# EasyEDA Pro project ProPrj_直流采样模块_2026-01-25.epro

# Schematic Schematic1
Board Name: Board1; Create Date: 2025-07-21; Page Name: P1; Project Name: 直流采样模块; Schematic Name: Schematic1; Update Date: 2025-07-21; Company: 嘉立创EDA; Page Size: A2; Version: V1.0
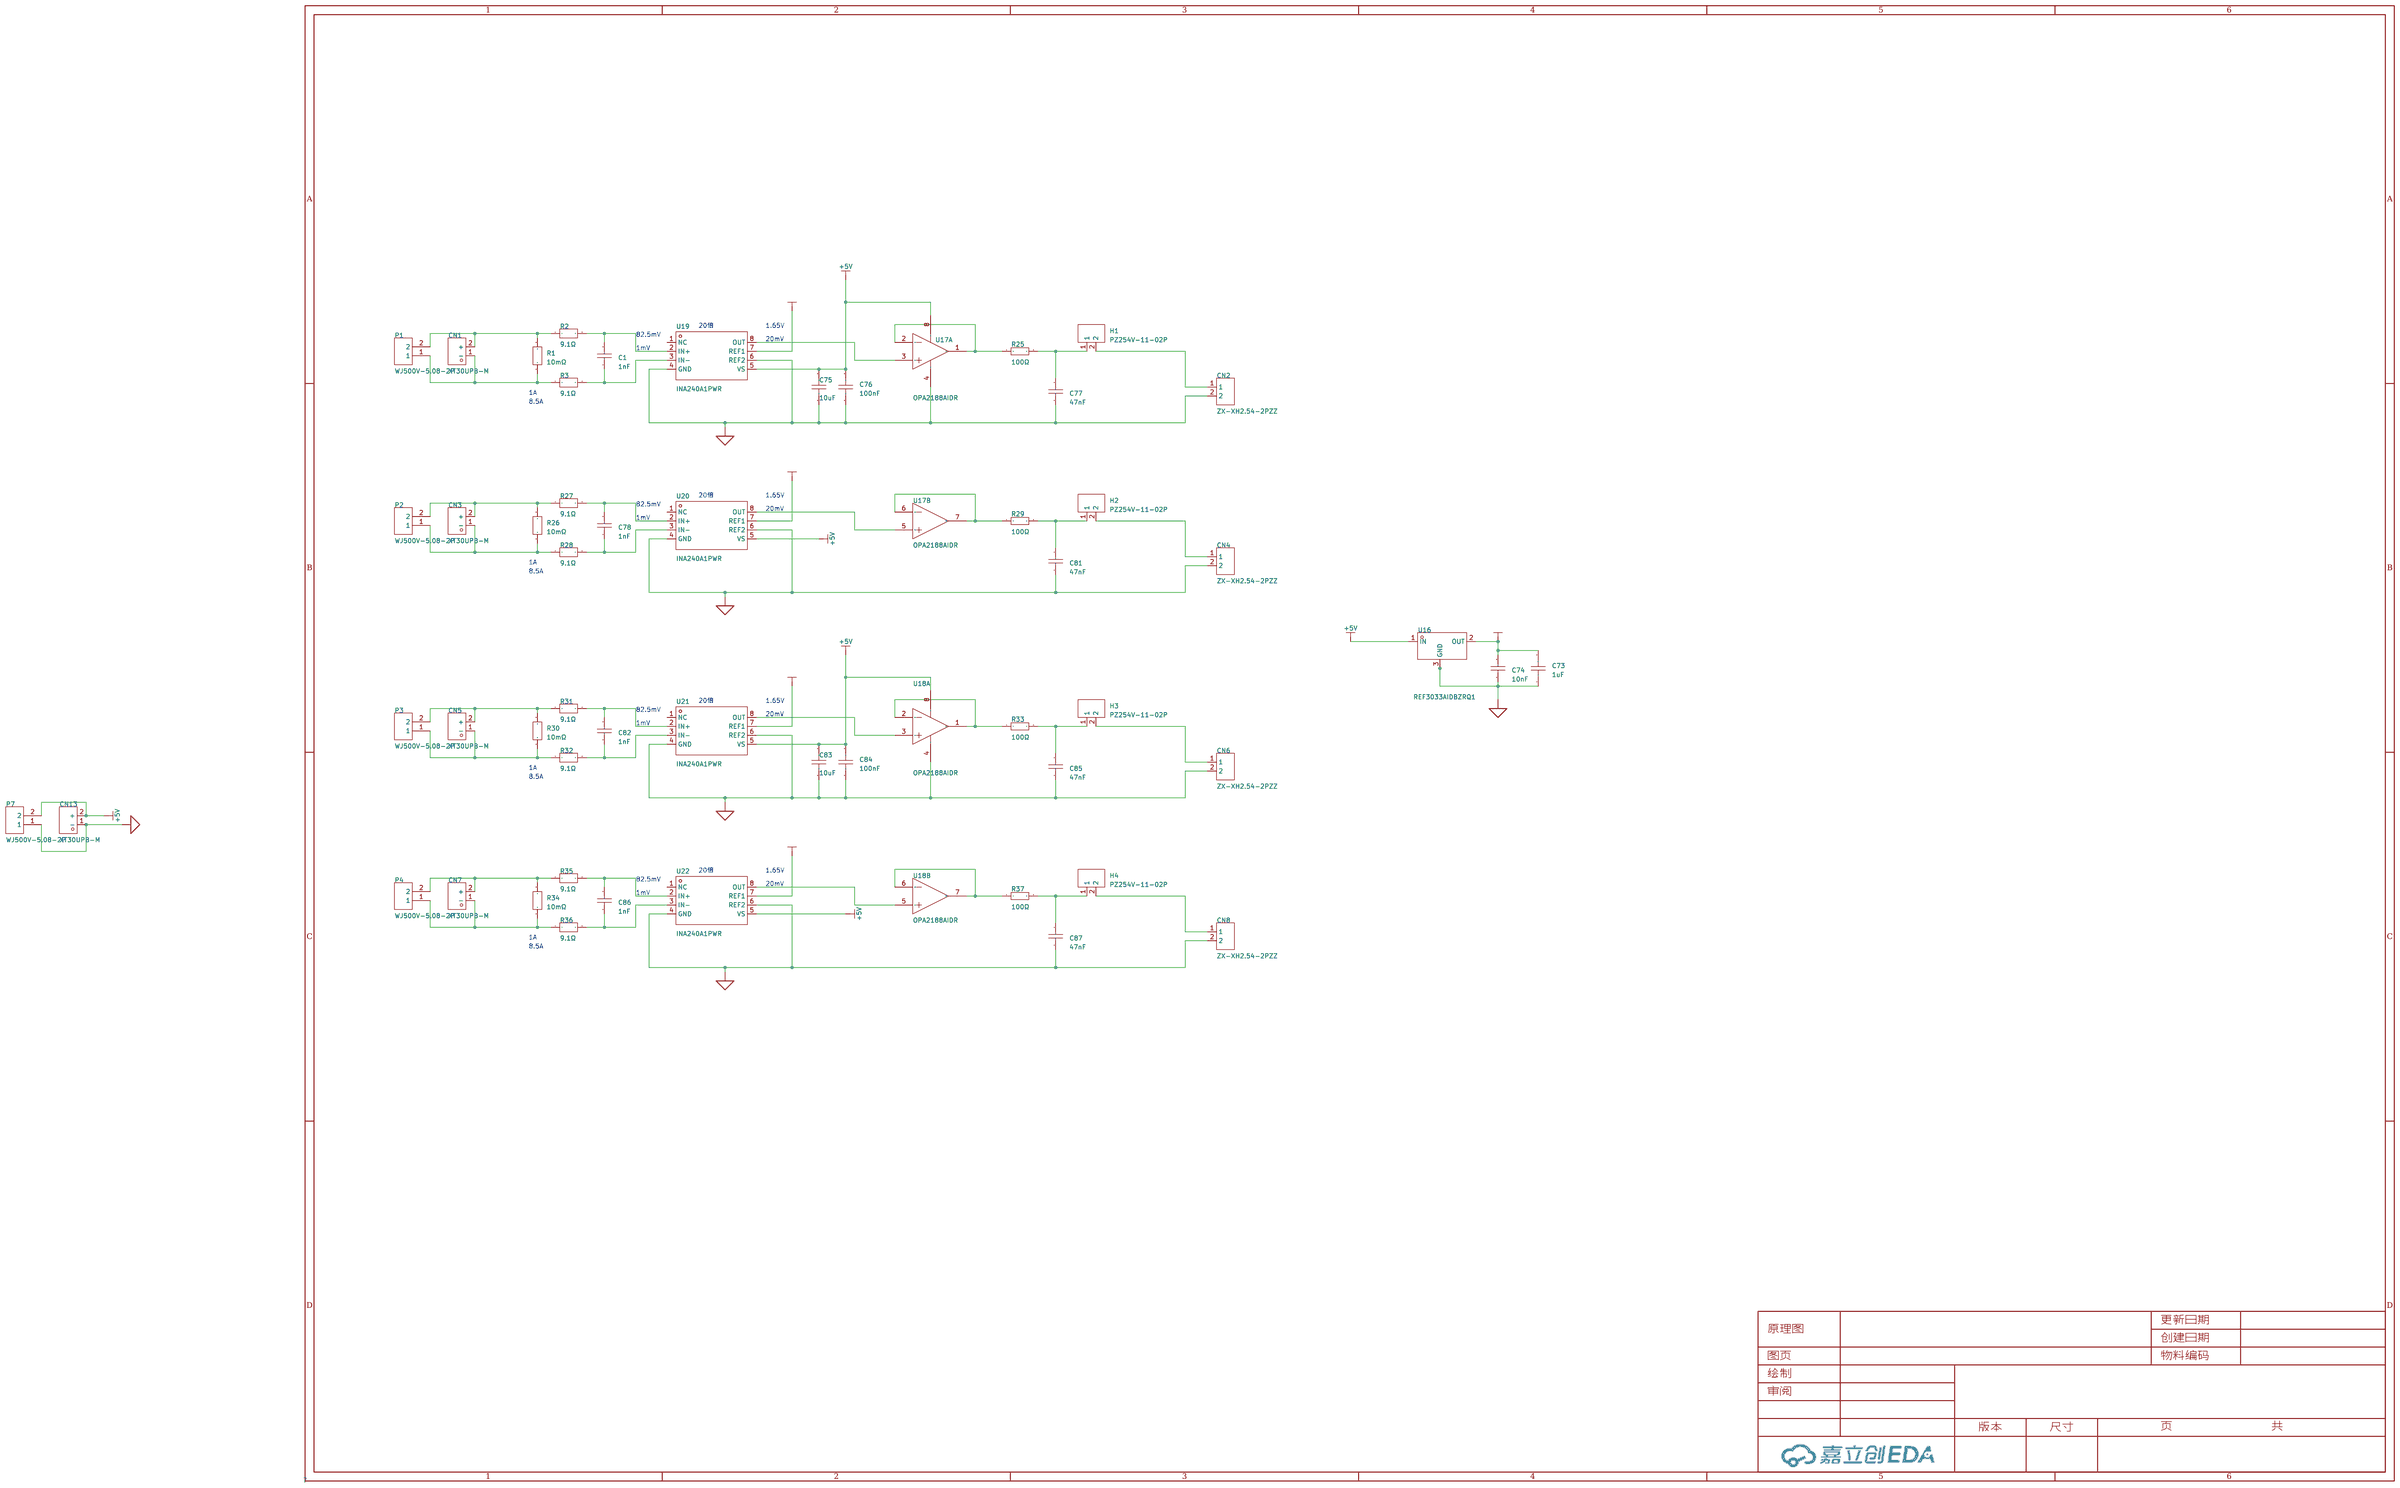
[diagram p0: schematic sheet]

## Parts
C1  1nF  [C0603]
C73  1uF  [C0603]
C74  10nF  [C0603]
C75  10uF  [C0603]
C76  100nF  [C0603]
C77  47nF  [C0603]
C78  1nF  [C0603]
C81  47nF  [C0603]
C82  1nF  [C0603]
C83  10uF  [C0603]
C84  100nF  [C0603]
C85  47nF  [C0603]
C86  1nF  [C0603]
C87  47nF  [C0603]
CN1  XT30UPB-M  [CONN-TH_XT30UPB-M]
CN2  ZX-XH2.54-2PZZ  [CONN-TH_2P-P2.50_HX25003-2A]
CN3  XT30UPB-M  [CONN-TH_XT30UPB-M]
CN4  ZX-XH2.54-2PZZ  [CONN-TH_2P-P2.50_HX25003-2A]
CN5  XT30UPB-M  [CONN-TH_XT30UPB-M]
CN6  ZX-XH2.54-2PZZ  [CONN-TH_2P-P2.50_HX25003-2A]
CN7  XT30UPB-M  [CONN-TH_XT30UPB-M]
CN8  ZX-XH2.54-2PZZ  [CONN-TH_2P-P2.50_HX25003-2A]
CN13  XT30UPB-M  [CONN-TH_XT30UPB-M]
H1  PZ254V-11-02P  [HDR-TH_2P-P2.54-V-M]
H2  PZ254V-11-02P  [HDR-TH_2P-P2.54-V-M]
H3  PZ254V-11-02P  [HDR-TH_2P-P2.54-V-M]
H4  PZ254V-11-02P  [HDR-TH_2P-P2.54-V-M]
P1  WJ500V-5.08-2P  [CONN-TH_2P-P5.00_WJ500V-5.08-2P]
P2  WJ500V-5.08-2P  [CONN-TH_2P-P5.00_WJ500V-5.08-2P]
P3  WJ500V-5.08-2P  [CONN-TH_2P-P5.00_WJ500V-5.08-2P]
P4  WJ500V-5.08-2P  [CONN-TH_2P-P5.00_WJ500V-5.08-2P]
P7  WJ500V-5.08-2P  [CONN-TH_2P-P5.00_WJ500V-5.08-2P]
R1  10mΩ  [R2512]
R2  9.1Ω  [R0603]
R3  9.1Ω  [R0603]
R25  100Ω  [R0603]
R26  10mΩ  [R2512]
R27  9.1Ω  [R0603]
R28  9.1Ω  [R0603]
R29  100Ω  [R0603]
R30  10mΩ  [R2512]
R31  9.1Ω  [R0603]
R32  9.1Ω  [R0603]
R33  100Ω  [R0603]
R34  10mΩ  [R2512]
R35  9.1Ω  [R0603]
R36  9.1Ω  [R0603]
R37  100Ω  [R0603]
U16  REF3033AIDBZRQ1  [SOT-23-3_L2.9-W1.3-P1.90-LS2.4-BR]
U17  OPA2188AIDR  [SOIC-8_L4.9-W3.9-P1.27-LS6.0-BL]  (sections 1,2)
U18  OPA2188AIDR  [SOIC-8_L4.9-W3.9-P1.27-LS6.0-BL]  (sections 1,2)
U19  INA240A1PWR  [TSSOP-8_L4.4-W3.0-P0.65-LS6.4-BL]
U20  INA240A1PWR  [TSSOP-8_L4.4-W3.0-P0.65-LS6.4-BL]
U21  INA240A1PWR  [TSSOP-8_L4.4-W3.0-P0.65-LS6.4-BL]
U22  INA240A1PWR  [TSSOP-8_L4.4-W3.0-P0.65-LS6.4-BL]

## Library data of the parts
C1 C78 C82 C86 = CL10B102KB8NNNC: 容值:1nF;精度:±10%;额定电压:50V;材质(温度系数):X7R;; LCSC Part Name: 1nF ±10% 50V; Supplier Part: C1588; Manufacturer: SAMSUNG(三星); Supplier Footprint: 0603; JLCPCB Part Class: 基础库; Datasheet: https://atta.szlcsc.com/upload/public/pdf/source/20160218/1457707763339.pdf; Supplier: LCSC; Tolerance: ±10%; Voltage Rated: 50V; Temperature Coefficient: X7R
C73 = CGA0603X5R105K500JT: 容值:1uF;精度:±10%;额定电压:50V;温度系数:X5R;; LCSC Part Name: 1uF ±10% 50V; Supplier Part: C6119852; Manufacturer: HRE(芯声); Supplier Footprint: 0603; JLCPCB Part Class: 扩展库; Supplier: LCSC; Tolerance: ±10%; Voltage Rating: 50V; Temperature Coefficient: X5R
C74 = CC0603KRX7R9BB103: 容值:10nF;精度:±10%;额定电压:50V;材质(温度系数):X7R;; LCSC Part Name: 10nF ±10% 50V; Supplier Part: C100042; Manufacturer: YAGEO(国巨); Supplier Footprint: 0603; JLCPCB Part Class: 扩展库; Datasheet: https://atta.szlcsc.com/upload/public/pdf/source/20181008/C309510_22F155564471FAF6A489F7D68F34234E.pdf; Supplier: LCSC; Tolerance: ±10%; Voltage Rated: 50V; Temperature Coefficient: X7R
C75 C83 = CGA0603X5R106K100JT: 容值:10uF;精度:±10%;额定电压:10V;温度系数:X5R;; LCSC Part Name: 10uF ±10% 10V; Supplier Part: C6119842; Manufacturer: HRE(芯声); Supplier Footprint: 0603; JLCPCB Part Class: 扩展库; Supplier: LCSC; Tolerance: ±10%; Voltage Rating: 10V; Temperature Coefficient: X5R
C76 C84 = CGA0603X7R104K500JT: 容值:100nF;精度:±10%;额定电压:50V;温度系数:X7R;; LCSC Part Name: 100nF ±10% 50V; Supplier Part: C6119867; Manufacturer: HRE(芯声); Supplier Footprint: 0603; JLCPCB Part Class: 扩展库; Datasheet: https://atta.szlcsc.com/upload/public/pdf/source/20250103/C44077DA9E7B3EFAE02F22B6D3D1CBC9.pdf; Supplier: LCSC; Tolerance: ±10%; Voltage Rating: 50V; Temperature Coefficient: X7R
C77 C81 C85 C87 = CL10B473KB8NNNC: 容值:47nF;精度:±10%;额定电压:50V;材质(温度系数):X7R;; LCSC Part Name: 47nF ±10% 50V; Supplier Part: C1622; Manufacturer: SAMSUNG(三星); Supplier Footprint: 0603; JLCPCB Part Class: 基础库; Datasheet: https://atta.szlcsc.com/upload/public/pdf/source/20160218/1457707763339.pdf; Supplier: LCSC; Tolerance: ±10%; Voltage Rated: 50V; Temperature Coefficient: X7R
CN1 CN3 CN5 CN7 CN13 = XT30UPB-M: 类别:-;类型1:-;; LCSC Part Name: AMASS(艾迈斯)板载立式 航模锂电池控制器连接器插头 公头XT30UPB-M; Supplier Part: C428721; Manufacturer: AMASS(艾迈斯); JLCPCB Part Class: 扩展库; Datasheet: https://atta.szlcsc.com/upload/public/pdf/source/20230412/7B5DFEF57C9EA5273853390C734B3AC5.pdf; Supplier: LCSC; Type: 航模插头; Colour: 黄色; RatedVoltage: DC 500V; InterfaceType: 公头; MetalMaterial: 镀金; InsulationMaterial: PA; RatedCurrent: 15A; contact resistance: 0.65mΩ
CN2 CN4 CN6 CN8 = ZX-XH2.54-2PZZ: 插针结构:1x2P;间距:2.5mm;安装方式:直插;参考系列:XH;总PIN数:2P;排数:1;每排PIN数:2;行距:-;额定电流:3A;触头材质:黄铜;触头镀层:锡;工作温度:-25℃~+85℃;; LCSC Part Name: 1x2P 间距:2.5mm 直插 系列:XH; Supplier Part: C7429632; Manufacturer: Megastar(兆星); Supplier Footprint: 插件,P=2.5mm; JLCPCB Part Class: 扩展库; Datasheet: https://atta.szlcsc.com/upload/public/pdf/source/20230619/19BA6947230AA44A04D3EDD65E618FD0.pdf; Supplier: LCSC; Pins Structure: 1x2P; Pitch: 2.5mm; Mounting Type: 直插; Reference Series: XH; Number of Pins: 2P; Number of Rows: 1; Number of PINs Per Row: 2; Current Rating: 3A; Contact Material: 黄铜; Contact Plating: 锡; Operating Temperature: -25℃~+85℃; Voltage Rating: 250V; Plastic Material: PA66; Flame Retardant Rating: UL94V-0; Color: 白色; Z-Height of the Board: 7mm; X-Length of Bottom Edge on Board (Spacing Line): 7.5mm; Y-Width of Bottom Edge on Board: 5.9mm
H1-H4 = PZ254V-11-02P: 插针结构:1x2P;间距:2.54mm;行距:-;圆针/方针:方针;安装方式:直插;排数:单排;总PIN位数:2P;额定电流:-;额定电压:-;配合针长度:6mm;塑高:2.5mm;端接针长度:3mm;触头材质:黄铜;触头镀层:-;工作温度:-40℃~+105℃;颜色:黑色;; LCSC Part Name: 1x2P 间距:2.54mm 方针 直插; Supplier Part: C492401; Manufacturer: XFCN(兴飞); Supplier Footprint: 插件,P=2.54mm; JLCPCB Part Class: 扩展库; Datasheet: https://atta.szlcsc.com/upload/public/pdf/source/20200309/C492401_A812433581A9B211A7FFA413ADDFF0E5.pdf; Supplier: LCSC; Pin Structure: 1x2P; Pitch: 2.54mm; Circluar Pins/Square Pins: 方针; Mounting Type: 直插; Number of Rows: 单排; Number of Pins: 2P; Length of Mating Pin: 6mm; Insulation Height: 2.5mm; Length of End Connection Pin: 3mm; Contact Material: 黄铜; Operating Temperature: -40℃~+105℃; Color: 黑色
P1-P4 P7 = WJ500V-5.08-2P: 结构:1x2P;间距:5.08mm;颜色:绿色;安装方式:直插;额定电流:18A;额定电压:250V;排数:1;线规 - AWG:14~30;线规 - 平方毫米:2.5;每排PIN数:2;触头材质:-;触头镀层:-;工作温度范围:-40℃~+105℃;焊接温度(最大值):-;; LCSC Part Name: 1x2P 5.08mm 直插 排数:1 每排P数:2; Supplier Part: C8465; Manufacturer: KANGNEX(康奈克斯电气); Supplier Footprint: 插件,P=5.08mm; JLCPCB Part Class: 扩展库; Datasheet: https://atta.szlcsc.com/upload/public/pdf/source/20191225/C8465_02D34CE5B5B4A53DF5891601D97FA9F4.pdf; Supplier: LCSC; Structure: 1x2P; Pitch: 5.08mm; Color: 绿色; Mounting Style: 直插; Current Rating (Max): 18A; Voltage Rating (Max): 250V; Number of Pins: 2P; Number of Rows: 1; Wire Gauge - AWG: 14~30; Wire Gauge - mm2: 2.5; Number of PINs Per Row: 2; Operating Temperature Range: -40℃~+105℃; Screw Specification: M2.5
R1 R26 R30 R34 = HoYLR2512E-3W-1mR-1%: 电阻类型:采样电阻;阻值:1mΩ;精度:±1%;功率:3W;安装方式:贴片;; LCSC Part Name: 1mΩ ±1% 3W; Supplier Part: C5375452; Manufacturer: Milliohm(毫欧); Supplier Footprint: 2512; JLCPCB Part Class: 扩展库; Supplier: LCSC; Type: 采样电阻; Tolerance: ±1%; Power(Watts): 3W; Mounting Sytle: 贴片
R2 R3 R27 R28 R31 R32 R35 R36 = FRC0603F9R10TS: 电阻类型:厚膜电阻;阻值:9.1Ω;精度:±1%;功率:100mW;工作电压:75V;温度系数:±200ppm/℃;; LCSC Part Name: 9.1Ω ±1% 100mW 厚膜电阻; Supplier Part: C2930155; Manufacturer: FOJAN(富捷); Supplier Footprint: 0603; JLCPCB Part Class: 扩展库; Datasheet: https://atta.szlcsc.com/upload/public/pdf/source/20211221/925EC7D7225764EE0046F22065062C87.pdf; Supplier: LCSC; Type: 厚膜电阻; Tolerance: ±1%; Power(Watts): 100mW; Voltage-Supply(Max): 75V; Temperature Coefficient: ±200ppm/℃; Operating Temperature: -55℃~+155℃
R25 R29 R33 R37 = 0603WAF1000T5E: 电阻类型:厚膜电阻;阻值:100Ω;精度:±1%;功率:100mW;最大工作电压:75V;温度系数:±200ppm/℃;; LCSC Part Name: 100Ω ±1% 100mW 厚膜电阻; Supplier Part: C22775; Manufacturer: UNI-ROYAL(厚声); Supplier Footprint: 0603; JLCPCB Part Class: 基础库; Datasheet: https://atta.szlcsc.com/upload/public/pdf/source/20200306/C422600_1E6D84923E4A46A82E41ADD87F860B5C.pdf; Supplier: LCSC; Type: 厚膜电阻; Tolerance: ±1%; Power(Watts): 100mW; Overload Voltage (Max): 75V; Temperature Coefficient: ±200ppm/℃; Operating Temperature Range: -55℃~+155℃
U16 = REF3033AIDBZRQ1: 输出类型:固定;输入电压:3.35V~5.5V;输出电压:3.3V;输出电流:25mA;精度:±0.2%;; Supplier Part: C3680001; Manufacturer: TI(德州仪器); Supplier Footprint: SOT-23-3; JLCPCB Part Class: 扩展库; Datasheet: https://www.ti.com/cn/lit/gpn/ref3033-q1; Supplier: LCSC; Output Type: 固定; Input Voltage: 3.35V~5.5V; Output Voltage: 3.3V; Output Current: 25mA; Tolerance: ±0.2%; Temperature Coefficient: 75ppm/℃; Reference Type: 串联; Supply Current: 50uA; Noise - 1/10Hz to 10Hz: 36uVp-p; Noise - 10Hz to 10kHz: 105uVrms; Operating Temperature: -40℃~+85℃@(Ta)
U17 U18 = OPA2188AIDR: 放大器数:双路;增益带宽积(GBP):2MHz;输入偏置电流(Ib):160pA;输入失调电压(Vos):6uV;压摆率(SR):0.8V/us;带宽(-3db):-;轨到轨:-;; LCSC Part Name: OPA2188AIDR  零漂移; Supplier Part: C17271; Manufacturer: TI(德州仪器); Supplier Footprint: SOIC-8; JLCPCB Part Class: 扩展库; Datasheet: https://www.ti.com/cn/lit/gpn/opa2188; Supplier: LCSC; Number of Circuits: 双路; Gain Bandwidth Product(GBP): 2MHz; Current - Input Bias(Ib): 160pA; Voltage - Input Offset(Vos): 6uV; Slew Rate(SR): 0.8V/us; Supply Current: 415uA; Operating Temperature: -40℃~+105℃
U19-U22 = INA240A1PWR: 放大器数:单路;; Supplier Part: C93965; Manufacturer: TI(德州仪器); Supplier Footprint: TSSOP-8; JLCPCB Part Class: 扩展库; Datasheet: https://www.ti.com/cn/lit/gpn/ina240; Supplier: LCSC; Number of Channels: 单路; Supply Current: 1.8mA; Operating Temperature: -40℃~+125℃

## Nets
+5V: C75.2 C76.2 C83.2 C84.2 CN13.2(+) P7.2 U16.1(IN) U17.8(V+) U18.8(V+) U19.5(VS) U20.5(VS) U21.5(VS) U22.5(VS)
AGND: C73.1 C74.1 C75.1 C76.1 C77.1 C81.1 C83.1 C84.1 C85.1 C87.1 CN2.2 CN4.2 CN6.2 CN8.2 CN13.1(-) P7.1 U16.3(GND) U17.4(V-) U18.4(V-) U19.4(GND) U19.6(REF2) U20.4(GND) U20.6(REF2) U21.4(GND) U21.6(REF2) U22.4(GND) U22.6(REF2)
VREF: C73.2 C74.2 U16.2(OUT) U19.7(REF1) U20.7(REF1) U21.7(REF1) U22.7(REF1)
$1N413: CN1.2(+) P1.2 R1.2 R2.1
$1N418: CN1.1(-) P1.1 R1.1 R3.1
$1N424: C1.2 R2.2 U19.2(IN+)
$1N430: C1.1 R3.2 U19.3(IN-)
$1N1225: U17.3(IN A+) U19.8(OUT)
$1N1231: R25.1 U17.1(OUT A) U17.2(IN A-)
$1N1896: C77.2 H1.1 R25.2
$1N2024: CN2.1 H1.2
$1N2786: CN3.2(+) P2.2 R26.2 R27.1
$1N2793: CN3.1(-) P2.1 R26.1 R28.1
$1N2800: C78.2 R27.2 U20.2(IN+)
$1N2806: C78.1 R28.2 U20.3(IN-)
$1N2841: U17.5(IN B+) U20.8(OUT)
$1N2845: R29.1 U17.6(IN B-) U17.7(OUT B)
$1N2851: C81.2 H2.1 R29.2
$1N2855: CN4.1 H2.2
$1N3511: CN5.2(+) P3.2 R30.2 R31.1
$1N3518: CN5.1(-) P3.1 R30.1 R32.1
$1N3525: C82.2 R31.2 U21.2(IN+)
$1N3531: C82.1 R32.2 U21.3(IN-)
$1N3566: U18.3(IN A+) U21.8(OUT)
$1N3570: R33.1 U18.1(OUT A) U18.2(IN A-)
$1N3576: C85.2 H3.1 R33.2
$1N3580: CN6.1 H3.2
$1N4143: CN7.2(+) P4.2 R34.2 R35.1
$1N4150: CN7.1(-) P4.1 R34.1 R36.1
$1N4157: C86.2 R35.2 U22.2(IN+)
$1N4163: C86.1 R36.2 U22.3(IN-)
$1N4185: U18.5(IN B+) U22.8(OUT)
$1N4189: R37.1 U18.6(IN B-) U18.7(OUT B)
$1N4195: C87.2 H4.1 R37.2
$1N4199: CN8.1 H4.2

Not connected (* = marked no-connect by the designer): U19 1(NC); U20 1(NC); U21 1(NC); U22 1(NC)

## Notes on the sheet
- 20倍
- 1.65V
- 82.5mV
- 20mV
- 1mV
- 1A
- 8.5A
- 20倍
- 1.65V
- 82.5mV
- 20mV
- 1mV
- 1A
- 8.5A
- 20倍
- 1.65V
- 82.5mV
- 20mV
- 1mV
- 1A
- 8.5A
- 82.5mV
- 20倍
- 1.65V
- 20mV
- 1mV
- 1A
- 8.5A

# Schematic Schematic3
Board Name: 电压采样; Create Date: 2025-07-26; Page Name: P1; Project Name: 直流采样模块; Schematic Name: Schematic3; Update Date: 2025-07-26; Company: 嘉立创EDA; Page Size: A2; Version: V1.0
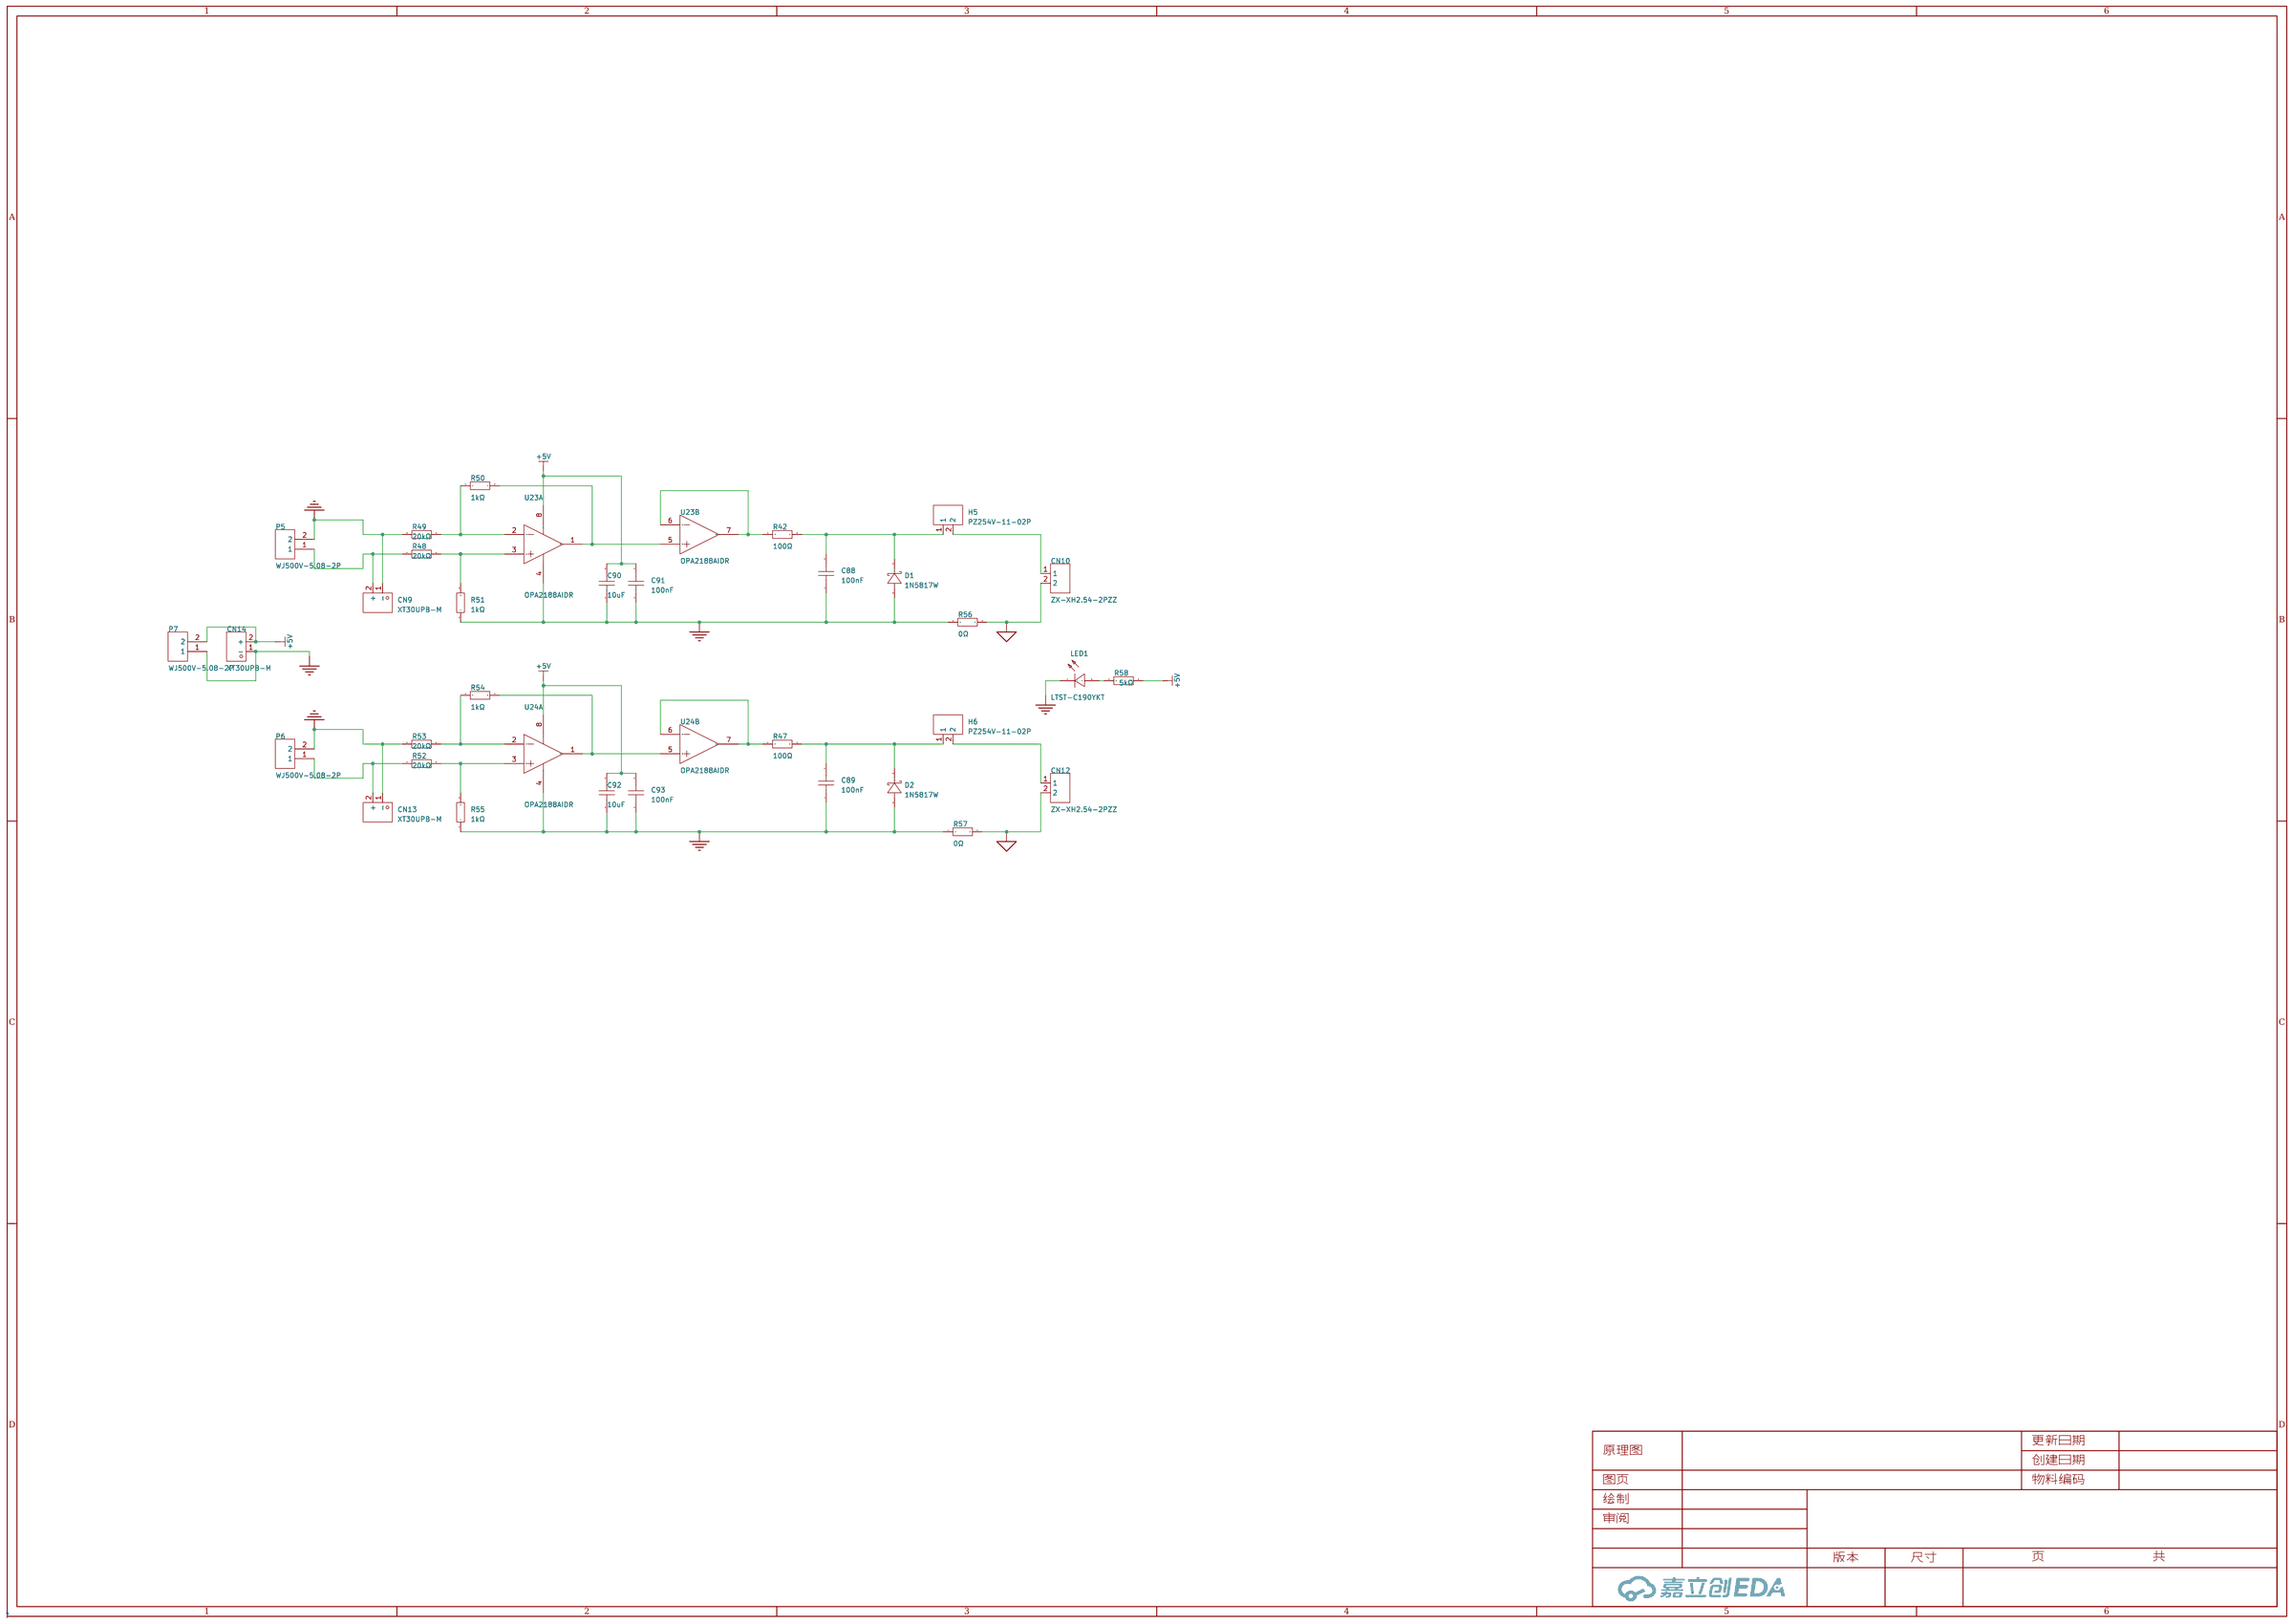
[diagram p1: schematic sheet]

## Parts
C88  100nF  [C0603]
C89  100nF  [C0603]
C90  10uF  [C0603]
C91  100nF  [C0603]
C92  10uF  [C0603]
C93  100nF  [C0603]
CN9  XT30UPB-M  [CONN-TH_XT30UPB-M]
CN10  ZX-XH2.54-2PZZ  [CONN-TH_2P-P2.50_HX25003-2A]
CN12  ZX-XH2.54-2PZZ  [CONN-TH_2P-P2.50_HX25003-2A]
CN13  XT30UPB-M  [CONN-TH_XT30UPB-M]
CN14  XT30UPB-M  [CONN-TH_XT30UPB-M]
D1  1N5817W  [SOD-123_L2.8-W1.8-LS3.7-RD]
D2  1N5817W  [SOD-123_L2.8-W1.8-LS3.7-RD]
H5  PZ254V-11-02P  [HDR-TH_2P-P2.54-V-M]
H6  PZ254V-11-02P  [HDR-TH_2P-P2.54-V-M]
LED1  LTST-C190YKT  [LED0603-RD]
P5  WJ500V-5.08-2P  [CONN-TH_2P-P5.00_WJ500V-5.08-2P]
P6  WJ500V-5.08-2P  [CONN-TH_2P-P5.00_WJ500V-5.08-2P]
P7  WJ500V-5.08-2P  [CONN-TH_2P-P5.00_WJ500V-5.08-2P]
R42  100Ω  [R0603]
R47  100Ω  [R0603]
R48  20kΩ  [R0603]
R49  20kΩ  [R0603]
R50  1kΩ  [R0603]
R51  1kΩ  [R0603]
R52  20kΩ  [R0603]
R53  20kΩ  [R0603]
R54  1kΩ  [R0603]
R55  1kΩ  [R0603]
R56  0Ω  [R0603]
R57  0Ω  [R0603]
R58  5kΩ  [R0603]
U23  OPA2188AIDR  [SOIC-8_L4.9-W3.9-P1.27-LS6.0-BL]  (sections 1,2)
U24  OPA2188AIDR  [SOIC-8_L4.9-W3.9-P1.27-LS6.0-BL]  (sections 1,2)

## Library data of the parts
C88 C89 C91 C93 = CGA0603X7R104K500JT: 容值:100nF;精度:±10%;额定电压:50V;温度系数:X7R;; LCSC Part Name: 100nF ±10% 50V; Supplier Part: C6119867; Manufacturer: HRE(芯声); Supplier Footprint: 0603; JLCPCB Part Class: 扩展库; Datasheet: https://atta.szlcsc.com/upload/public/pdf/source/20250103/C44077DA9E7B3EFAE02F22B6D3D1CBC9.pdf; Supplier: LCSC; Tolerance: ±10%; Voltage Rating: 50V; Temperature Coefficient: X7R
C90 C92 = CGA0603X5R106K100JT: 容值:10uF;精度:±10%;额定电压:10V;温度系数:X5R;; LCSC Part Name: 10uF ±10% 10V; Supplier Part: C6119842; Manufacturer: HRE(芯声); Supplier Footprint: 0603; JLCPCB Part Class: 扩展库; Supplier: LCSC; Tolerance: ±10%; Voltage Rating: 10V; Temperature Coefficient: X5R
CN9 CN13 CN14 = XT30UPB-M: 类别:-;类型1:-;; LCSC Part Name: AMASS(艾迈斯)板载立式 航模锂电池控制器连接器插头 公头XT30UPB-M; Supplier Part: C428721; Manufacturer: AMASS(艾迈斯); JLCPCB Part Class: 扩展库; Datasheet: https://atta.szlcsc.com/upload/public/pdf/source/20230412/7B5DFEF57C9EA5273853390C734B3AC5.pdf; Supplier: LCSC; Type: 航模插头; Colour: 黄色; RatedVoltage: DC 500V; InterfaceType: 公头; MetalMaterial: 镀金; InsulationMaterial: PA; RatedCurrent: 15A; contact resistance: 0.65mΩ
CN10 CN12 = ZX-XH2.54-2PZZ: 插针结构:1x2P;间距:2.5mm;安装方式:直插;参考系列:XH;总PIN数:2P;排数:1;每排PIN数:2;行距:-;额定电流:3A;触头材质:黄铜;触头镀层:锡;工作温度:-25℃~+85℃;; LCSC Part Name: 1x2P 间距:2.5mm 直插 系列:XH; Supplier Part: C7429632; Manufacturer: Megastar(兆星); Supplier Footprint: 插件,P=2.5mm; JLCPCB Part Class: 扩展库; Datasheet: https://atta.szlcsc.com/upload/public/pdf/source/20230619/19BA6947230AA44A04D3EDD65E618FD0.pdf; Supplier: LCSC; Pins Structure: 1x2P; Pitch: 2.5mm; Mounting Type: 直插; Reference Series: XH; Number of Pins: 2P; Number of Rows: 1; Number of PINs Per Row: 2; Current Rating: 3A; Contact Material: 黄铜; Contact Plating: 锡; Operating Temperature: -25℃~+85℃; Voltage Rating: 250V; Plastic Material: PA66; Flame Retardant Rating: UL94V-0; Color: 白色; Z-Height of the Board: 7mm; X-Length of Bottom Edge on Board (Spacing Line): 7.5mm; Y-Width of Bottom Edge on Board: 5.9mm
D1 D2 = 1N5817W: 二极管配置:独立式;正向压降(Vf):750mV@3A;直流反向耐压(Vr):20V;整流电流:1A;; LCSC Part Name: 电压:20V 电流:1A; Supplier Part: C727113; Manufacturer: TWGMC(台湾迪嘉); Supplier Footprint: SOD-123; JLCPCB Part Class: 扩展库; Datasheet: https://atta.szlcsc.com/upload/public/pdf/source/20200828/C727113_260B72EC53C389C21DF1E8AB243F1BFC.pdf; Supplier: LCSC; Diode Configuration: 独立式; Forward Voltage (Vf@If): 750mV@3A; Reverse Voltage (Vr): 20V; Rectified Current: 1A; Reverse Leakage Current (Ir): 1mA
H5 H6 = PZ254V-11-02P: 插针结构:1x2P;间距:2.54mm;行距:-;圆针/方针:方针;安装方式:直插;排数:单排;总PIN位数:2P;额定电流:-;额定电压:-;配合针长度:6mm;塑高:2.5mm;端接针长度:3mm;触头材质:黄铜;触头镀层:-;工作温度:-40℃~+105℃;颜色:黑色;; LCSC Part Name: 1x2P 间距:2.54mm 方针 直插; Supplier Part: C492401; Manufacturer: XFCN(兴飞); Supplier Footprint: 插件,P=2.54mm; JLCPCB Part Class: 扩展库; Datasheet: https://atta.szlcsc.com/upload/public/pdf/source/20200309/C492401_A812433581A9B211A7FFA413ADDFF0E5.pdf; Supplier: LCSC; Pin Structure: 1x2P; Pitch: 2.54mm; Circluar Pins/Square Pins: 方针; Mounting Type: 直插; Number of Rows: 单排; Number of Pins: 2P; Length of Mating Pin: 6mm; Insulation Height: 2.5mm; Length of End Connection Pin: 3mm; Contact Material: 黄铜; Operating Temperature: -40℃~+105℃; Color: 黑色
LED1 = LTST-C190YKT: 发光颜色:黄色;正向电压(VF):2.1V;功率:60mW;正向电流:20mA;主波长:588nm;二极管配置:-;透镜颜色:无色透明透镜;色温:-;发光强度:6mcd;发光角度:130°;载带方式:-;工作温度:-55℃~+85℃;; LCSC Part Name: 黄灯; Supplier Part: C125097; Manufacturer: LITEON(光宝); Supplier Footprint: 0603; JLCPCB Part Class: 扩展库; Datasheet: https://atta.szlcsc.com/upload/public/pdf/source/20180326/C125097_8A610ECE31461EDC7D081EA09A856E73.pdf; Supplier: LCSC; Emitted Color: 黄色; Forward Voltage (VF): 2.1V; Power Dissipation: 60mW; Forward Current: 20mA; Dominant Wavelength: 588nm; Peak Wavelength: 585nm; Lens Color: 无色透明透镜; Luminous Intensity: 6mcd; Viewing Angle: 130°; Operating Temperature: -55℃~+85℃
P5-P7 = WJ500V-5.08-2P: 结构:1x2P;间距:5.08mm;颜色:绿色;安装方式:直插;额定电流:18A;额定电压:250V;排数:1;线规 - AWG:14~30;线规 - 平方毫米:2.5;每排PIN数:2;触头材质:-;触头镀层:-;工作温度范围:-40℃~+105℃;焊接温度(最大值):-;; LCSC Part Name: 1x2P 5.08mm 直插 排数:1 每排P数:2; Supplier Part: C8465; Manufacturer: KANGNEX(康奈克斯电气); Supplier Footprint: 插件,P=5.08mm; JLCPCB Part Class: 扩展库; Datasheet: https://atta.szlcsc.com/upload/public/pdf/source/20191225/C8465_02D34CE5B5B4A53DF5891601D97FA9F4.pdf; Supplier: LCSC; Structure: 1x2P; Pitch: 5.08mm; Color: 绿色; Mounting Style: 直插; Current Rating (Max): 18A; Voltage Rating (Max): 250V; Number of Pins: 2P; Number of Rows: 1; Wire Gauge - AWG: 14~30; Wire Gauge - mm2: 2.5; Number of PINs Per Row: 2; Operating Temperature Range: -40℃~+105℃; Screw Specification: M2.5
R42 R47 = 0603WAF1000T5E: 电阻类型:厚膜电阻;阻值:100Ω;精度:±1%;功率:100mW;最大工作电压:75V;温度系数:±200ppm/℃;; LCSC Part Name: 100Ω ±1% 100mW 厚膜电阻; Supplier Part: C22775; Manufacturer: UNI-ROYAL(厚声); Supplier Footprint: 0603; JLCPCB Part Class: 基础库; Datasheet: https://atta.szlcsc.com/upload/public/pdf/source/20200306/C422600_1E6D84923E4A46A82E41ADD87F860B5C.pdf; Supplier: LCSC; Type: 厚膜电阻; Tolerance: ±1%; Power(Watts): 100mW; Overload Voltage (Max): 75V; Temperature Coefficient: ±200ppm/℃; Operating Temperature Range: -55℃~+155℃
R48 R49 R52 R53 = 0603WAF2002T5E: 电阻类型:厚膜电阻;阻值:20kΩ;精度:±1%;功率:100mW;最大工作电压:75V;温度系数:±100ppm/℃;; LCSC Part Name: 20kΩ ±1% 100mW 厚膜电阻; Supplier Part: C4184; Manufacturer: UNI-ROYAL(厚声); Supplier Footprint: 0603; JLCPCB Part Class: 基础库; Datasheet: https://atta.szlcsc.com/upload/public/pdf/source/20200306/C422600_1E6D84923E4A46A82E41ADD87F860B5C.pdf; Supplier: LCSC; Type: 厚膜电阻; Tolerance: ±1%; Power(Watts): 100mW; Overload Voltage (Max): 75V; Temperature Coefficient: ±100ppm/℃; Operating Temperature Range: -55℃~+155℃
R50 R51 R54 R55 = 0603WAF1001T5E: 电阻类型:厚膜电阻;阻值:1kΩ;精度:±1%;功率:100mW;最大工作电压:75V;温度系数:±100ppm/℃;; LCSC Part Name: 1kΩ ±1% 100mW 厚膜电阻; Supplier Part: C21190; Manufacturer: UNI-ROYAL(厚声); Supplier Footprint: 0603; JLCPCB Part Class: 基础库; Datasheet: https://atta.szlcsc.com/upload/public/pdf/source/20200306/C422600_1E6D84923E4A46A82E41ADD87F860B5C.pdf; Supplier: LCSC; Type: 厚膜电阻; Tolerance: ±1%; Power(Watts): 100mW; Overload Voltage (Max): 75V; Temperature Coefficient: ±100ppm/℃; Operating Temperature Range: -55℃~+155℃
R56 R57 = 0603WAF0000T5E: 电阻类型:厚膜电阻;阻值:0Ω;精度:±1%;功率:100mW;最大工作电压:75V;; LCSC Part Name: 0Ω ±1% 100mW 厚膜电阻; Supplier Part: C21189; Manufacturer: UNI-ROYAL(厚声); Supplier Footprint: 0603; JLCPCB Part Class: 基础库; Datasheet: https://atta.szlcsc.com/upload/public/pdf/source/20200306/C422600_1E6D84923E4A46A82E41ADD87F860B5C.pdf; Supplier: LCSC; Type: 厚膜电阻; Tolerance: ±1%; Power(Watts): 100mW; Overload Voltage (Max): 75V; Operating Temperature Range: -55℃~+155℃
R58 = RT0603BRE075KL: 电阻类型:薄膜电阻;阻值:5kΩ;精度:±0.1%;功率:100mW;温度系数:±50ppm/℃;; LCSC Part Name: 薄膜电阻 5kΩ ±0.1% 100mW; Supplier Part: C862232; Manufacturer: YAGEO(国巨); Supplier Footprint: 0603; JLCPCB Part Class: 扩展库; Datasheet: https://atta.szlcsc.com/upload/public/pdf/source/20200610/C326738_5639A9F1B6EB6E4AE2197577D3456E7F.pdf; Supplier: LCSC; Type: 薄膜电阻; Tolerance: ±0.1%; Power(Watts): 100mW; Temperature Coefficient: ±50ppm/℃; Operating Temperature Range: -55℃~+155℃
U23 U24 = OPA2188AIDR: 放大器数:双路;增益带宽积(GBP):2MHz;输入偏置电流(Ib):160pA;输入失调电压(Vos):6uV;压摆率(SR):0.8V/us;带宽(-3db):-;轨到轨:-;; LCSC Part Name: OPA2188AIDR  零漂移; Supplier Part: C17271; Manufacturer: TI(德州仪器); Supplier Footprint: SOIC-8; JLCPCB Part Class: 扩展库; Datasheet: https://www.ti.com/cn/lit/gpn/opa2188; Supplier: LCSC; Number of Circuits: 双路; Gain Bandwidth Product(GBP): 2MHz; Current - Input Bias(Ib): 160pA; Voltage - Input Offset(Vos): 6uV; Slew Rate(SR): 0.8V/us; Supply Current: 415uA; Operating Temperature: -40℃~+105℃

## Nets
+5V: C90.2 C91.2 C92.2 C93.2 CN14.2(+) P7.2 R58.2 U23.8(V+) U24.8(V+)
AGND: CN10.2 CN12.2 R56.2 R57.2
GND: C88.1 C89.1 C90.1 C91.1 C92.1 C93.1 CN9.1(-) CN13.1(-) CN14.1(-) D1.2(A) D2.2(A) LED1.1(-) P5.2 P6.2 P7.1 R49.1 R51.1 R53.1 R55.1 R56.1 R57.1 U23.4(V-) U24.4(V-)
$1N1331: R48.2 R51.2 U23.3(IN A+)
$1N1333: R49.2 R50.1 U23.2(IN A-)
$1N1334: R50.2 U23.1(OUT A) U23.5(IN B+)
$1N1336: R42.1 U23.6(IN B-) U23.7(OUT B)
$1N1337: C88.2 D1.1(C) H5.1 R42.2
$1N1340: CN13.2(+) P6.1 R52.1
$1N1341: R52.2 R55.2 U24.3(IN A+)
$1N1343: R53.2 R54.1 U24.2(IN A-)
$1N1344: R54.2 U24.1(OUT A) U24.5(IN B+)
$1N1346: R47.1 U24.6(IN B-) U24.7(OUT B)
$1N1347: C89.2 D2.1(C) H6.1 R47.2
$1N1643: CN9.2(+) P5.1 R48.1
$1N2062: LED1.2(+) R58.1
Net-(CN10-1): CN10.1 H5.2
Net-(CN12-1): CN12.1 H6.2

# Board PCB2
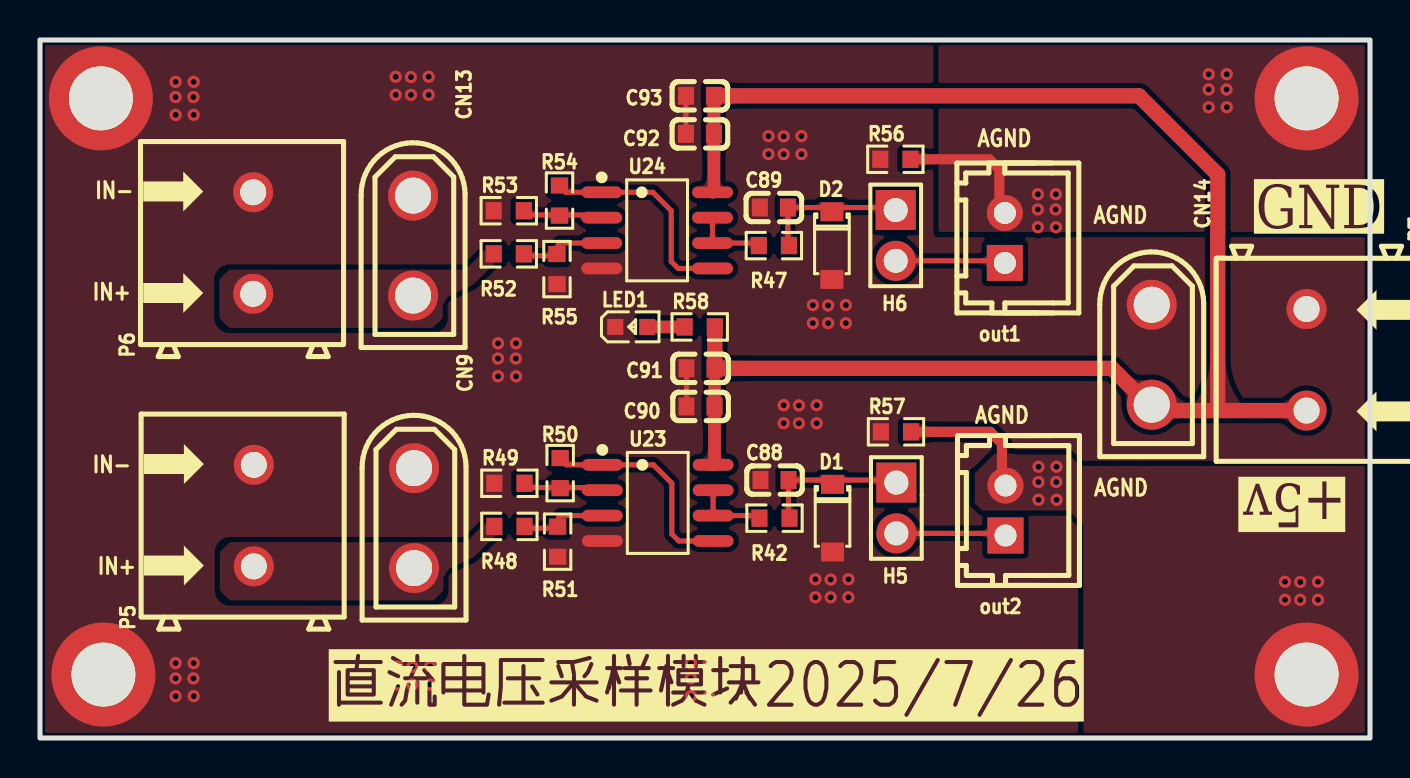
[diagram p2: board, top side]
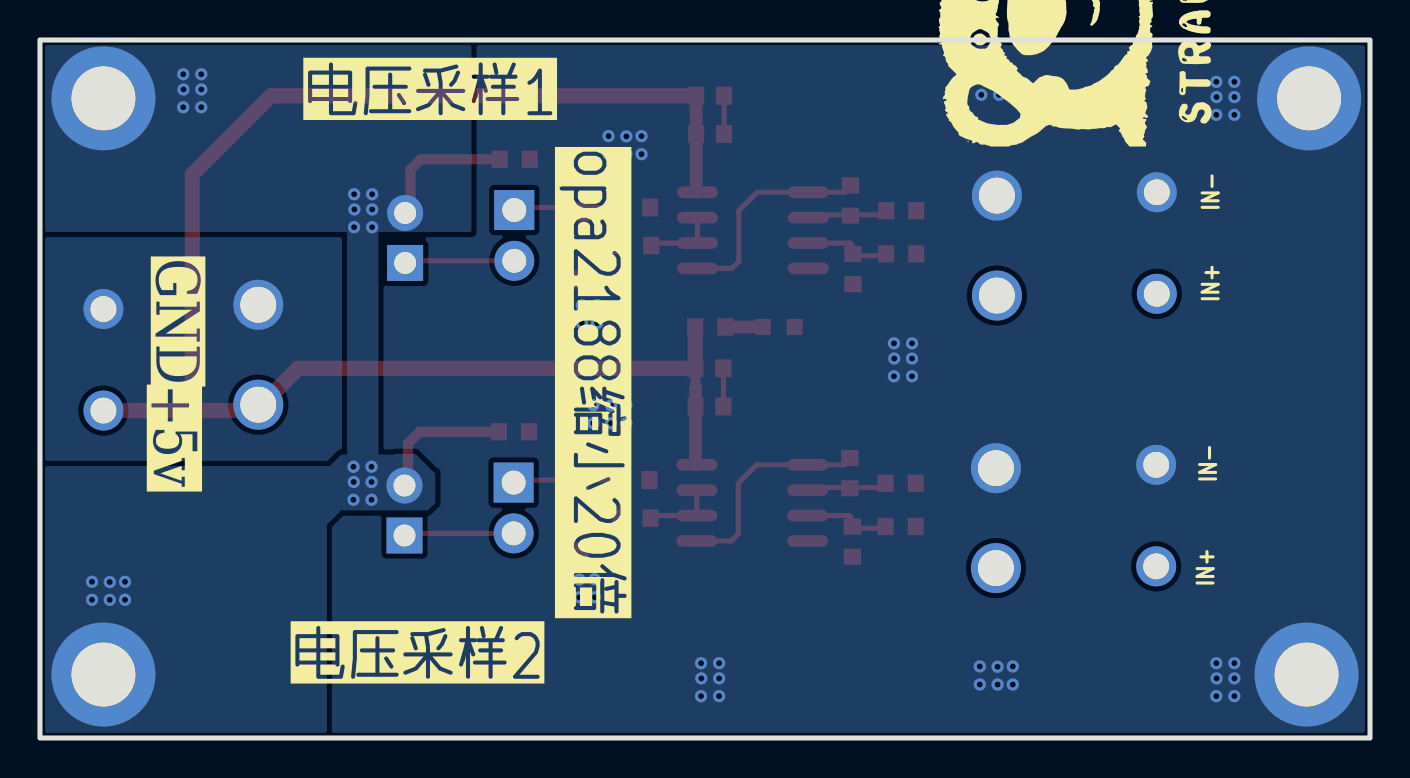
[diagram p3: board, bottom side, seen from below]

Outline 66.55 x 34.93 mm; copper layers: Top Layer, Bottom Layer. Coordinates in mm from the lower left corner of the outline.
Outline path: rectangle 0,34.93 66.55,0
Stack: Top Layer 0.035mm / Dielectric1 1.51mm FR4 er 4.5 / Bottom Layer 0.035mm

## Design rules (mm)
template: 自定义配置
spacing copperThickness1oz (default): track to track 0.102, other pairs 0.152 to 0.3
spacing copperThickness2oz: track to track 0.203, other pairs 0.152 to 0.3
track width copperThickness1oz (default): min 0.127, default 0.254, max 2.54
track width copperThickness2oz: min 0.203, default 0.254, max 2.54
differential pair differentialPair (default): width min 0.127, default 0.254, max 2.54; gap min 0.152, default 0.152
via viaSize (default): diameter min 0.5, default 0.61, max 10; hole min 0.3, default 0.305, max 6.3

## Placement (name value [footprint] x y rotation side)
C88  100nF  [C0603]  36.75 12.91 0 top
C89  100nF  [C0603]  36.72 26.54 0 top
C90  10uF  [C0603]  33.05 16.59 0 top
C91  100nF  [C0603]  33.05 18.49 0 top
C92  10uF  [C0603]  33.02 30.23 0 top
C93  100nF  [C0603]  33.02 32.13 0 top
CN9  XT30UPB-M  [CONN-TH_XT30UPB-M]  18.72 11 270 top
CN13  XT30UPB-M  [CONN-TH_XT30UPB-M]  18.67 24.64 270 top
CN14  XT30UPB-M  [CONN-TH_XT30UPB-M]  55.63 19.18 270 top
D1  1N5817W  [SOD-123_L2.8-W1.8-LS3.7-RD]  39.66 11 270 top
D2  1N5817W  [SOD-123_L2.8-W1.8-LS3.7-RD]  39.62 24.64 270 top
H5  PZ254V-11-02P  [HDR-TH_2P-P2.54-V-M]  42.85 11.51 270 top
H6  PZ254V-11-02P  [HDR-TH_2P-P2.54-V-M]  42.82 25.15 270 top
LED1  LTST-C190YKT  [LED0603-RD]  29.58 20.57 0 top
NOREF  -  [Pad_e166]  3.05 32 0 top
NOREF#2  -  [Pad_e167]  63.37 32 0 top
NOREF#3  -  [Pad_e168]  63.37 3.18 0 top
NOREF#4  -  [Pad_e165]  3.17 3.18 0 top
out1  ZX-XH2.54-2PZZ  [CONN-TH_2P-P2.50_HX25003-2A]  48.28 25.02 90 top
out2  ZX-XH2.54-2PZZ  [CONN-TH_2P-P2.50_HX25003-2A]  48.31 11.38 90 top
P5  WJ500V-5.08-2P  [CONN-TH_2P-P5.00_WJ500V-5.08-2P]  10.7 11.13 90 top
P6  WJ500V-5.08-2P  [CONN-TH_2P-P5.00_WJ500V-5.08-2P]  10.67 24.77 90 top
P7  WJ500V-5.08-2P  [CONN-TH_2P-P5.00_WJ500V-5.08-2P]  63.37 18.92 270 top
R42  100Ω  [R0603]  36.75 11 0 top
R47  100Ω  [R0603]  36.72 24.64 0 top
R48  20kΩ  [R0603]  23.49 10.59 0 top
R49  20kΩ  [R0603]  23.49 12.75 0 top
R50  1kΩ  [R0603]  26.03 13.25 90 top
R51  1kΩ  [R0603]  25.9 9.83 90 top
R52  20kΩ  [R0603]  23.45 24.22 0 top
R53  20kΩ  [R0603]  23.45 26.38 0 top
R54  1kΩ  [R0603]  25.99 26.89 90 top
R55  1kΩ  [R0603]  25.87 23.46 90 top
R56  0Ω  [R0603]  42.8 28.96 0 top
R57  0Ω  [R0603]  42.83 15.32 0 top
R58  5kΩ  [R0603]  33.01 20.57 0 top
U23  OPA2188AIDR  [SOIC-8_L4.9-W3.9-P1.27-LS6.0-BL]  30.91 11.76 270 top
U24  OPA2188AIDR  [SOIC-8_L4.9-W3.9-P1.27-LS6.0-BL]  30.88 25.4 270 top

## Footprints (pads in the part's own frame, mm; a bottom-side part is the same pattern mirrored in y, then rotated)
C0603
  rect 0.8x0.9 smd: 1(-0.7,0) 2(0.7,0)
CONN-TH_2P-P2.50_HX25003-2A
  rect 1.8x1.8 hole 1.1: 1(-1.25,0)
  round 1.8 hole 1.1: 2(1.25,0)
CONN-TH_2P-P5.00_WJ500V-5.08-2P
  round 2 hole 1.3: 1(-2.54,0) 2(2.54,0)
CONN-TH_XT30UPB-M
  round 2.5 hole 1.8: 1(-2.5,0) 2(2.5,0)
HDR-TH_2P-P2.54-V-M
  rect 2x2 hole 1.2: 1(-1.27,0)
  round 2 hole 1.2: 2(1.27,0)
LED0603-RD
  rect 0.8x0.8 smd: 1(-0.799,0) 2(0.799,0)
Pad_e165
  round 5.2 hole 3.2: 1(0,0)
Pad_e166
  round 5.2 hole 3.2: 1(0,0)
Pad_e167
  round 5.2 hole 3.2: 1(0,0)
Pad_e168
  round 5.2 hole 3.2: 1(0,0)
R0603
  rect 0.806x0.864 smd: 1(-0.753,0) 2(0.753,0)
SOD-123_L2.8-W1.8-LS3.7-RD
  rect 0.95x1.15 smd: 1(-1.692,0) 2(1.692,0)
SOIC-8_L4.9-W3.9-P1.27-LS6.0-BL
  oval 0.588x2.045 smd: 1(-1.905,-2.772) 2(-0.635,-2.772) 3(0.635,-2.772) 4(1.905,-2.772) 5(1.905,2.772) 6(0.635,2.772) 7(-0.635,2.772) 8(-1.905,2.772)

## Nets
+5V: C90.2 C91.2 C92.2 C93.2 CN14.2 P7.2 R58.2 U23.8 U24.8
AGND: NOREF#2.1 NOREF#3.1 out1.2 out2.2 R56.2 R57.2
GND: C88.1 C89.1 C90.1 C91.1 C92.1 C93.1 CN9.1 CN13.1 CN14.1 D1.2 D2.2 LED1.1 NOREF.1 NOREF#4.1 P5.2 P6.2 P7.1 R49.1 R51.1 R53.1 R55.1 R56.1 R57.1 U23.4 U24.4
$1N1331: R48.2 R51.2 U23.3
$1N1333: R49.2 R50.1 U23.2
$1N1334: R50.2 U23.1 U23.5
$1N1336: R42.1 U23.6 U23.7
$1N1337: C88.2 D1.1 H5.1 R42.2
$1N1338: H5.2 out2.1
$1N1340: CN13.2 P6.1 R52.1
$1N1341: R52.2 R55.2 U24.3
$1N1343: R53.2 R54.1 U24.2
$1N1344: R54.2 U24.1 U24.5
$1N1346: R47.1 U24.6 U24.7
$1N1347: C89.2 D2.1 H6.1 R47.2
$1N1348: H6.2 out1.1
$1N1643: CN9.2 P5.1 R48.1
$1N2062: LED1.2 R58.1

## Via types
v1: diameter 0.61, hole 0.305, Top Layer to Bottom Layer, 84 vias

## Routing (per net, layer and track width the routed paths; a pad name or vN(x,y) marks a point on that pad's centre or on a via; arc(x,y) is an arc through that point)
+5V: length 81.2
  Top Layer w0.508: C91.2 33.75,17.54
  Top Layer w0.635: 33.75,17.54 C90.2 33.75,13.74 U23.8 ; C93.2 C92.2 33.72,27.37 U24.8
  Top Layer w0.762: 55.92,16.38 55.75,16.38 53.64,18.49 33.96,18.49 ; 55.92,16.38 CN14.2 ; 55.92,16.38 63.37,16.38 ; 33.96,18.49 33.76,18.69 R58.2 ; 33.96,18.49 C91.2 ; C93.2 54.99,32.13 58.93,28.19 58.93,16.64
AGND: length 13.9
  Top Layer w0.508: out1.2 48.01,26.54 48.01,28.45 47.5,28.96 R56.2 ; R57.2 47.55,15.32 48.13,14.73 48.13,12.81 out2.2
  vias: v1(49.93,27.21) v1(49.93,26.45) v1(49.93,25.56) v1(49.96,13.57) v1(49.96,12.81) v1(49.96,11.92) v1(50.83,27.21) v1(50.82,26.45) v1(50.83,25.56) v1(50.86,13.57) v1(50.85,12.81) v1(50.86,11.92) v1(58.48,33.21) v1(58.47,32.45) v1(58.48,31.56) v1(59.37,32.45) v1(59.38,33.21) v1(59.38,31.56) v1(62.29,7.82) v1(62.29,6.92) v1(63.06,7.8) v1(63.06,6.91) v1(63.94,7.82) v1(63.94,6.92)
GND: length 3.8
  Top Layer w0.254: C91.1 C90.1 ; C93.1 C92.1
  vias: v1(6.79,32.83) v1(6.79,32.07) v1(6.79,31.18) v1(6.79,3.75) v1(6.79,2.98) v1(6.79,2.1) v1(7.69,32.83) v1(7.68,32.07) v1(7.69,31.18) v1(7.69,3.75) v1(7.68,2.98) v1(7.69,2.1) v1(17.8,33.08) v1(17.8,32.18) v1(17.87,3.58) v1(17.87,2.68) v1(18.56,33.07) v1(18.56,32.18) v1(18.64,3.57) v1(18.64,2.68) v1(19.45,33.08) v1(19.45,32.18) v1(19.52,3.58) v1(19.52,2.68) v1(22.92,19.75) v1(22.92,18.99) v1(22.92,18.1) v1(23.82,19.75) v1(23.81,18.99) v1(23.82,18.1) v1(32.57,3.75) v1(32.57,2.98) v1(32.57,2.1) v1(33.47,3.75) v1(33.46,2.98) v1(33.47,2.1) v1(36.45,30.11) v1(36.45,29.21) v1(37.21,30.1) v1(37.21,29.21) v1(37.21,16.65) v1(37.21,15.75) v1(37.97,16.64) v1(37.97,15.75) v1(38.1,30.12) v1(38.1,29.21) v1(38.67,21.66) v1(38.67,20.76) v1(38.86,16.65) v1(38.86,15.75) v1(38.8,7.94) v1(38.8,7.04) v1(39.43,21.65) v1(39.43,20.76) v1(39.56,7.93) v1(39.56,7.04) v1(40.32,21.66) v1(40.32,20.76) v1(40.45,7.95) v1(40.45,7.04)
$1N1331: length 4.4
  Top Layer w0.254: U23.3 26.06,11.13 25.96,11.03 25.96,10.48 25.95,10.49 24.3,10.49
$1N1333: length 3.9
  Top Layer w0.254: U23.2 28,12.53 24.42,12.53 24.3,12.65
$1N1334: length 10.9
  Top Layer w0.254: 25.96,14.04 26.33,13.67 U23.1 30.69,13.67 31.61,12.75 31.61,10.21 31.96,9.86 U23.5
$1N1336: length 3.6
  Top Layer w0.254: R42.1 35.87,11.13 U23.6 U23.7
$1N1337: length 7.4
  Top Layer w0.254: R42.2 37.45,11.05 C88.2 42.72,12.91 H5.1
$1N1338: length 5.5
  Top Layer w0.254: H5.2 48.2,10.24 out2.1
$1N1341: length 4.4
  Top Layer w0.254: U24.3 26.03,24.77 25.93,24.66 25.93,24.12 25.92,24.13 24.27,24.13
$1N1343: length 3.9
  Top Layer w0.254: U24.2 27.97,26.17 24.38,26.17 24.27,26.29
$1N1344: length 10.9
  Top Layer w0.254: 25.93,27.68 26.3,27.31 U24.1 30.66,27.31 31.58,26.38 31.58,23.84 31.93,23.5 U24.5
$1N1346: length 3.6
  Top Layer w0.254: U24.7 U24.6 35.84,24.77 R47.1
$1N1347: length 7.4
  Top Layer w0.254: H6.1 42.69,26.54 C89.2 37.42,24.69 R47.2
$1N1348: length 5.5
  Top Layer w0.254: out1.1 48.17,23.88 H6.2
$1N2062: length 1.9
  Top Layer w0.635: R58.1 LED1.2

## Copper pours and planes (outline as drawn; the poured copper is in the pictures)
AGND on Top Layer: 44.96,34.93 66.41,34.93 66.41,25.32 44.96,25.32
AGND on Top Layer: 46.82,13.28 46.77,13.28 46.77,11.75 47.14,11.38 51.48,11.38 52.2,10.67 52.2,0 52.32,-0.13 66.55,-0.13 66.55,13.61 52.05,13.61 51.48,14.18 48.81,14.18 48.77,14.22 47.77,14.22
AGND on Bottom Layer: 46.82,13.28 46.77,13.28 46.77,11.75 47.14,11.38 51.48,11.38 52.2,10.67 52.2,0 52.32,-0.13 66.55,-0.13 66.55,13.61 52.05,13.61 51.48,14.18 48.81,14.18 48.77,14.22 47.77,14.22
AGND on Bottom Layer: 49.62,27.76 51.18,27.76 51.18,11.56 49.62,11.56
AGND on Bottom Layer: 44.96,34.93 66.41,34.93 66.41,25.32 44.96,25.32
GND on Top Layer: -2.67,37.08 68.58,37.08 68.58,-2.79 -2.67,-2.79
GND on Top Layer: 9.01,14.88 23.23,14.88 23.23,12.22 9.01,12.22
GND on Top Layer: 8.97,28.52 23.2,28.52 23.2,25.85 8.97,25.85
GND on Bottom Layer: -1.02,36.96 69.21,36.96 69.21,-3.05 -1.02,-3.05
$1N1340 on Top Layer: 8.97,24.58 22.78,24.58 22.78,20.52 8.97,20.52
$1N1643 on Top Layer: 9.01,10.95 22.82,10.95 22.82,6.88 9.01,6.88

Small or netless copper shapes (teardrops, artwork), in the pictures only: 72 on Top Layer

## Text on the board
Bottom Silkscreen Layer: IN- | IN+ | 电压采样1 | 电压采样2 | opa2188缩小20倍 | GND | +5v
Top Silkscreen Layer: IN+ | IN- | AGND | 直流电压采样模块2025/7/26 | GND | +5v

# Board PCB1
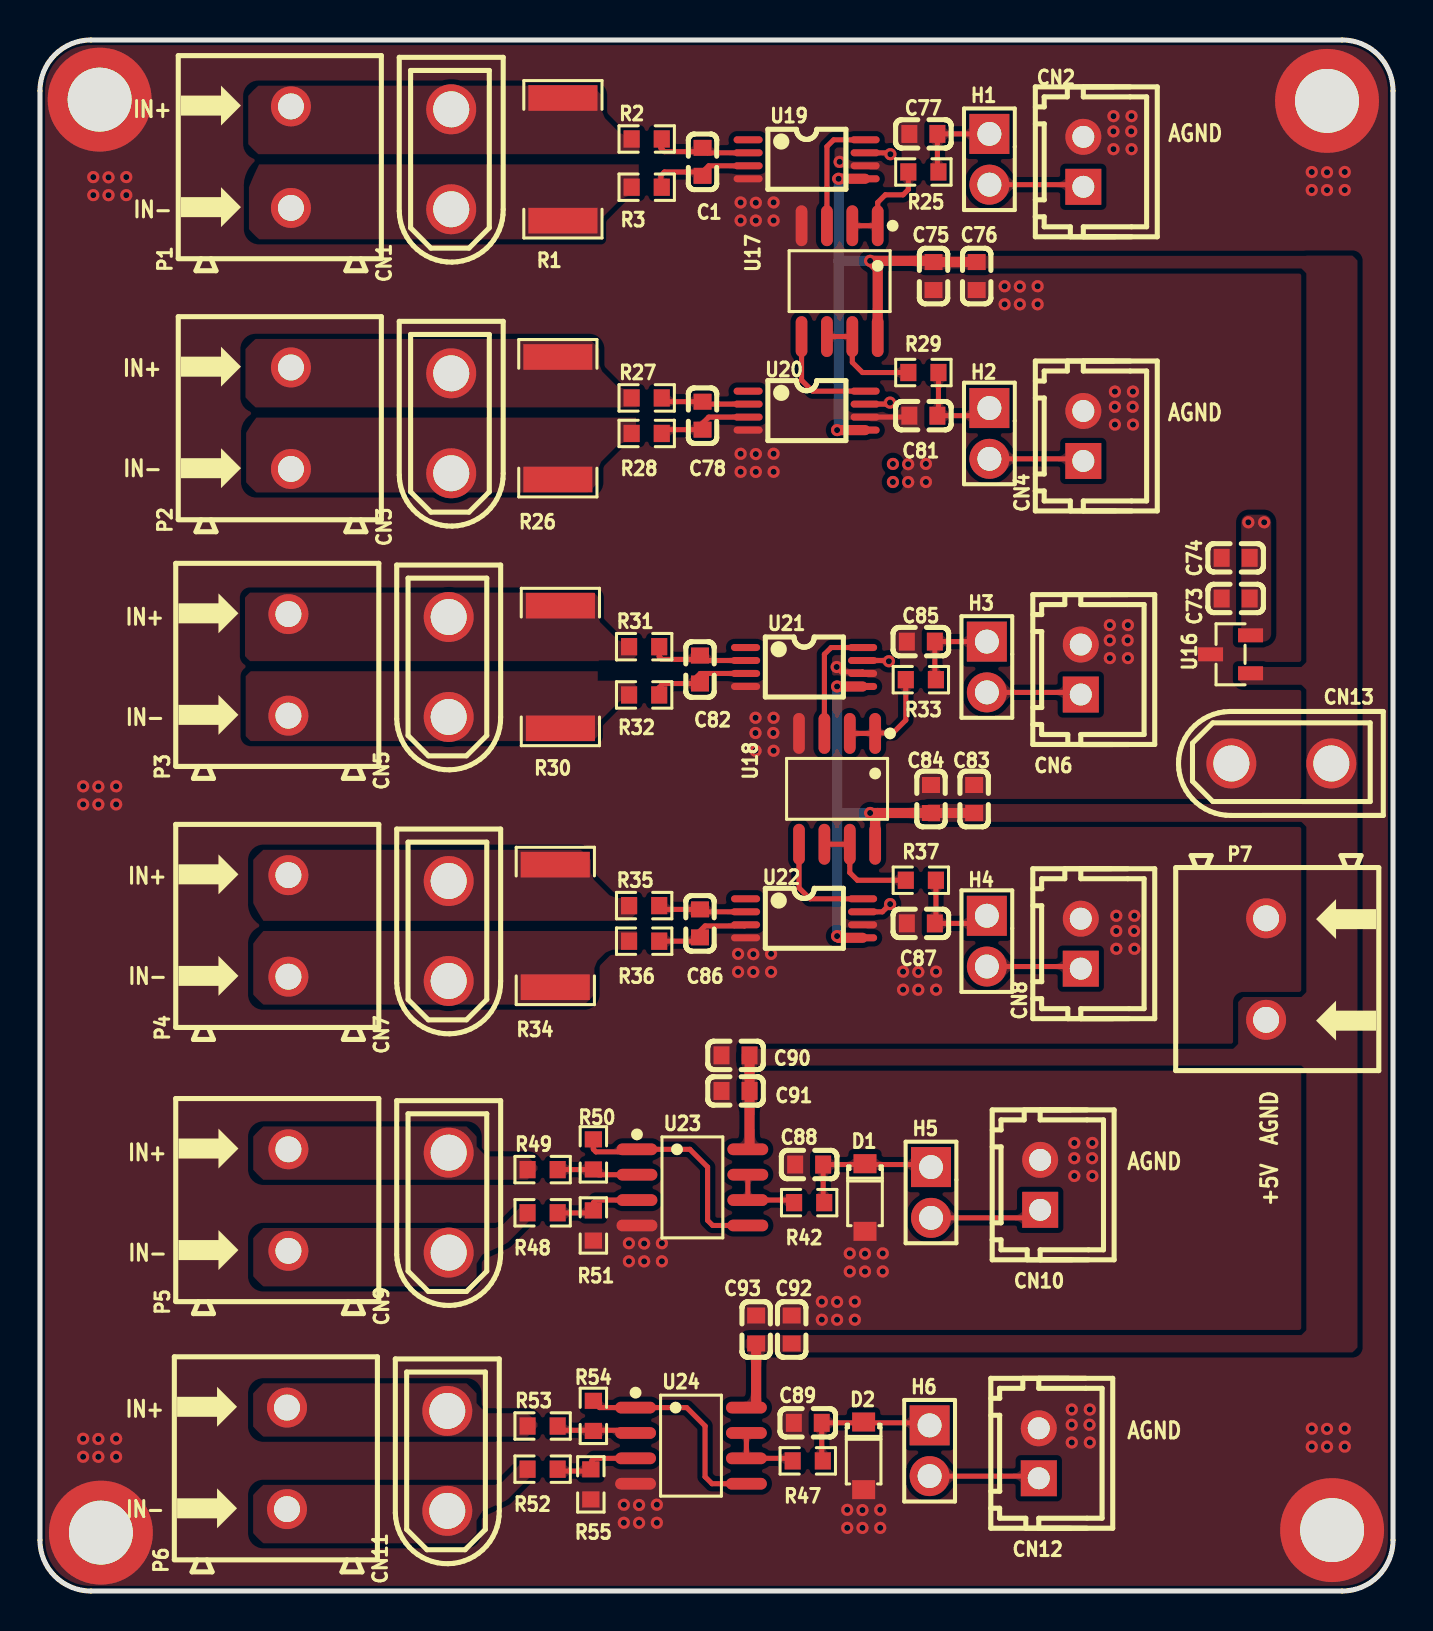
[diagram p4: board, top side]
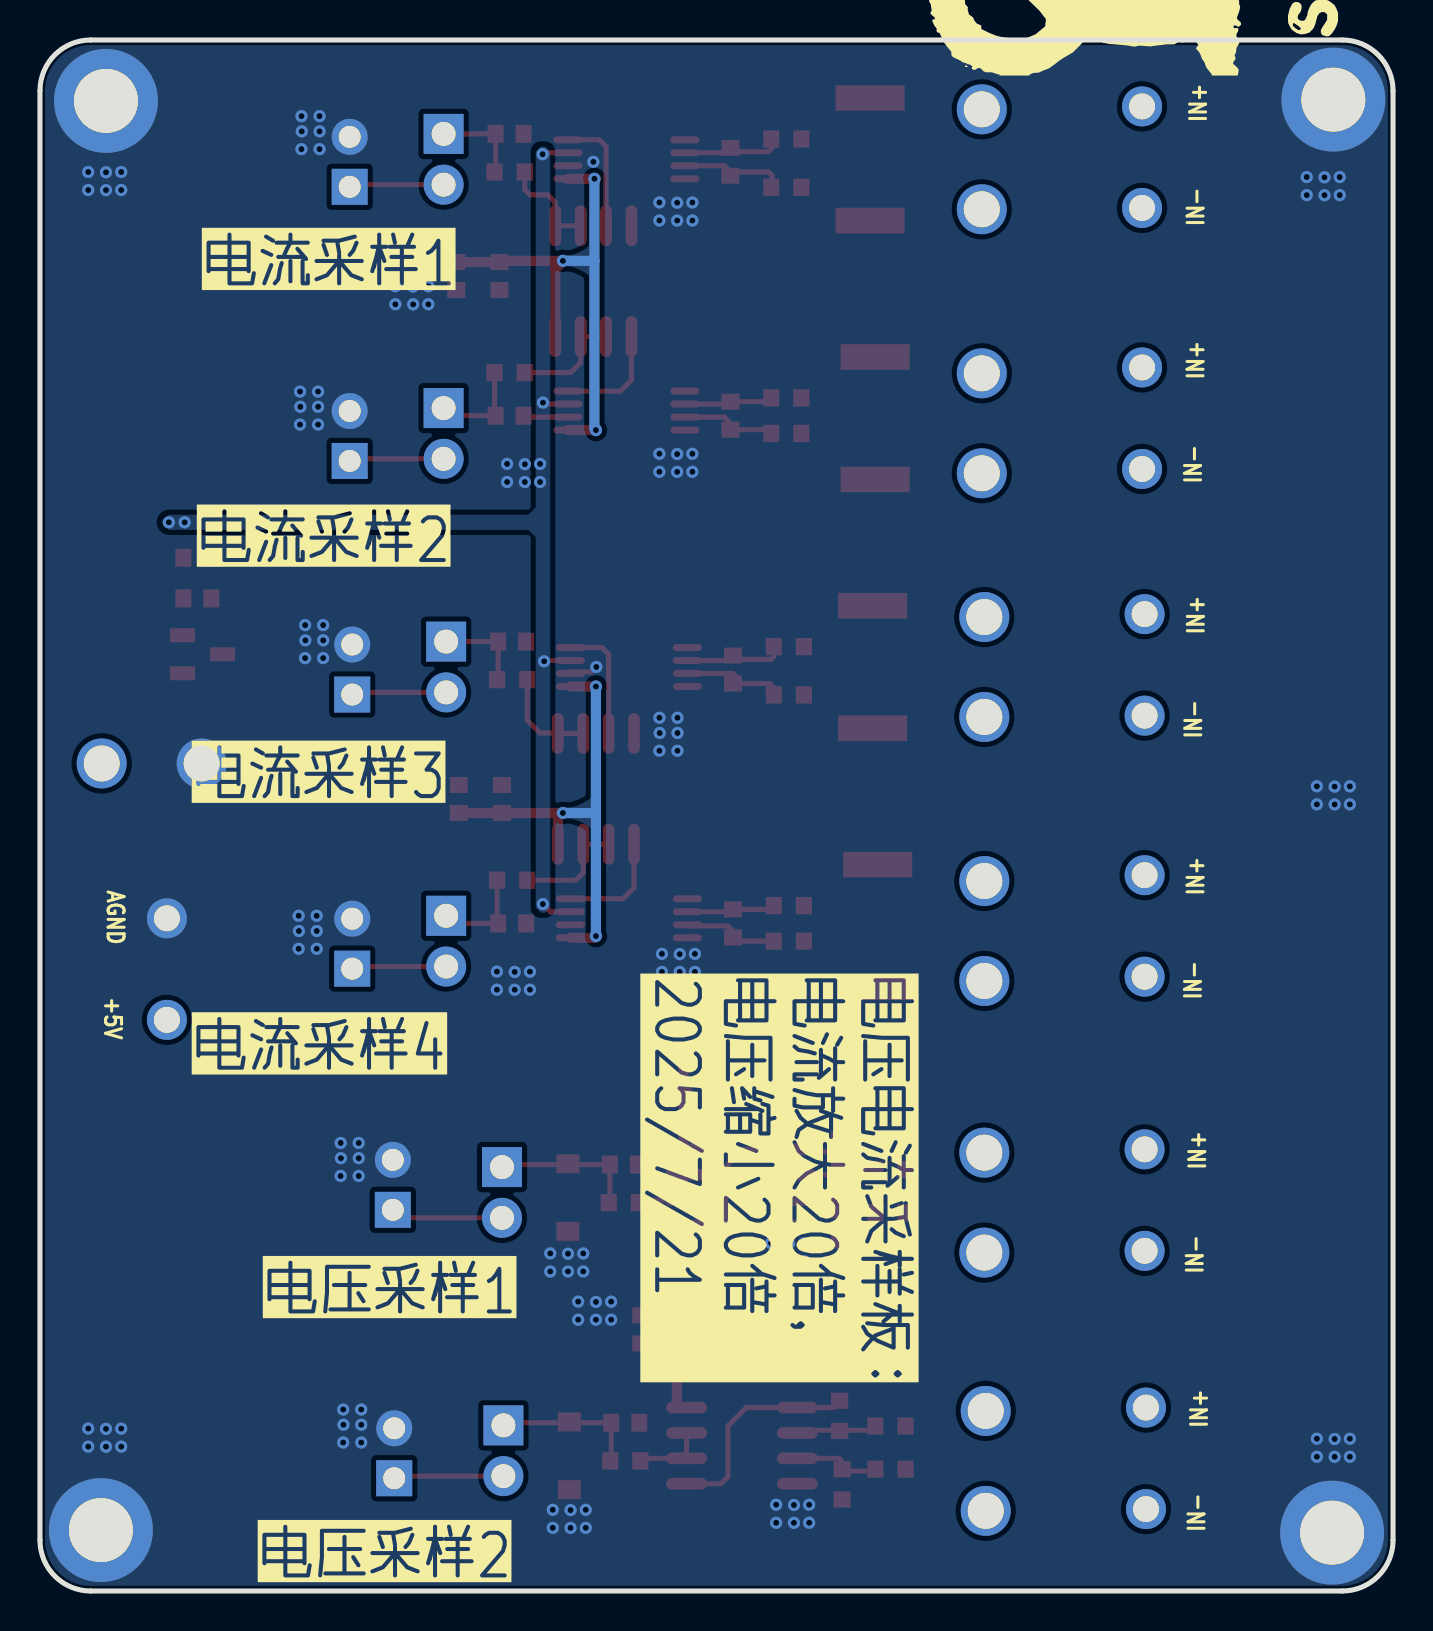
[diagram p5: board, bottom side, seen from below]

Outline 67.69 x 77.6 mm; copper layers: Top Layer, Bottom Layer. Coordinates in mm from the lower left corner of the outline.
Outline path: 0,75.06 0,2.54 arc(0.74,0.74) 2.54,0 65.15,0 arc(66.95,0.74) 67.69,2.54 67.69,75.06 arc(66.95,76.85) 65.15,77.6 2.54,77.6 arc(0.74,76.85) 0,75.06
Stack: Top Layer 0.035mm / Dielectric1 1.51mm FR4 er 4.5 / Bottom Layer 0.035mm

## Design rules (mm)
template: 自定义配置
spacing copperThickness1oz (default): track to track 0.102, other pairs 0.152 to 0.3
spacing copperThickness2oz: track to track 0.203, other pairs 0.152 to 0.3
track width copperThickness1oz (default): min 0.127, default 0.254, max 2.54
track width copperThickness2oz: min 0.203, default 0.254, max 2.54
differential pair differentialPair (default): width min 0.127, default 0.254, max 2.54; gap min 0.152, default 0.152
via viaSize (default): diameter min 0.5, default 0.61, max 10; hole min 0.3, default 0.305, max 6.3

## Placement (name value [footprint] x y rotation side)
C1  1nF  [C0603]  33.15 71.5 90 top
C73  1uF  [C0603]  59.82 49.66 0 top
C74  10nF  [C0603]  59.82 51.69 0 top
C75  10uF  [C0603]  44.7 65.79 90 top
C76  100nF  [C0603]  46.86 65.79 90 top
C77  47nF  [C0603]  44.2 72.9 0 top
C78  1nF  [C0603]  33.15 58.8 90 top
C81  47nF  [C0603]  44.2 58.8 0 top
C82  1nF  [C0603]  33.02 46.1 90 top
C83  10uF  [C0603]  46.74 39.62 270 top
C84  100nF  [C0603]  44.58 39.62 270 top
C85  47nF  [C0603]  44.07 47.5 0 top
C86  1nF  [C0603]  33.02 33.4 90 top
C87  47nF  [C0603]  44.07 33.4 0 top
C88  100nF  [C0603]  38.48 21.34 0 top
C89  100nF  [C0603]  38.41 8.42 0 top
C90  10uF  [C0603]  34.8 26.8 0 top
C91  100nF  [C0603]  34.8 25.02 0 top
C92  10uF  [C0603]  37.61 13.08 270 top
C93  100nF  [C0603]  35.83 13.08 270 top
CN1  XT30UPB-M  [CONN-TH_XT30UPB-M]  20.57 71.63 90 top
CN2  ZX-XH2.54-2PZZ  [CONN-TH_2P-P2.50_HX25003-2A]  52.2 71.5 90 top
CN3  XT30UPB-M  [CONN-TH_XT30UPB-M]  20.57 58.42 90 top
CN4  ZX-XH2.54-2PZZ  [CONN-TH_2P-P2.50_HX25003-2A]  52.2 57.79 90 top
CN5  XT30UPB-M  [CONN-TH_XT30UPB-M]  20.45 46.23 90 top
CN6  ZX-XH2.54-2PZZ  [CONN-TH_2P-P2.50_HX25003-2A]  52.07 46.1 90 top
CN7  XT30UPB-M  [CONN-TH_XT30UPB-M]  20.45 33.02 90 top
CN8  ZX-XH2.54-2PZZ  [CONN-TH_2P-P2.50_HX25003-2A]  52.07 32.39 90 top
CN9  XT30UPB-M  [CONN-TH_XT30UPB-M]  20.45 19.43 90 top
CN10  ZX-XH2.54-2PZZ  [CONN-TH_2P-P2.50_HX25003-2A]  50.04 20.32 90 top
CN11  XT30UPB-M  [CONN-TH_XT30UPB-M]  20.38 6.51 90 top
CN12  ZX-XH2.54-2PZZ  [CONN-TH_2P-P2.50_HX25003-2A]  49.97 6.89 90 top
CN13  XT30UPB-M  [CONN-TH_XT30UPB-M]  62.1 41.4 0 top
D1  1N5817W  [SOD-123_L2.8-W1.8-LS3.7-RD]  41.28 19.69 270 top
D2  1N5817W  [SOD-123_L2.8-W1.8-LS3.7-RD]  41.21 6.76 270 top
H1  PZ254V-11-02P  [HDR-TH_2P-P2.54-V-M]  47.5 71.63 270 top
H2  PZ254V-11-02P  [HDR-TH_2P-P2.54-V-M]  47.5 57.91 270 top
H3  PZ254V-11-02P  [HDR-TH_2P-P2.54-V-M]  47.37 46.23 270 top
H4  PZ254V-11-02P  [HDR-TH_2P-P2.54-V-M]  47.37 32.51 270 top
H5  PZ254V-11-02P  [HDR-TH_2P-P2.54-V-M]  44.58 19.94 270 top
H6  PZ254V-11-02P  [HDR-TH_2P-P2.54-V-M]  44.51 7.02 270 top
NOREF  -  [Pad_e1007]  64.39 74.55 180 top
NOREF#2  -  [Pad_e1006]  64.64 3.05 0 top
NOREF#3  -  [Pad_e1005]  3.05 2.92 0 top
NOREF#4  -  [Pad_e1009]  2.98 74.61 90 top
P1  WJ500V-5.08-2P  [CONN-TH_2P-P5.00_WJ500V-5.08-2P]  12.56 71.73 90 top
P2  WJ500V-5.08-2P  [CONN-TH_2P-P5.00_WJ500V-5.08-2P]  12.56 58.67 90 top
P3  WJ500V-5.08-2P  [CONN-TH_2P-P5.00_WJ500V-5.08-2P]  12.43 46.33 90 top
P4  WJ500V-5.08-2P  [CONN-TH_2P-P5.00_WJ500V-5.08-2P]  12.43 33.27 90 top
P5  WJ500V-5.08-2P  [CONN-TH_2P-P5.00_WJ500V-5.08-2P]  12.43 19.56 90 top
P6  WJ500V-5.08-2P  [CONN-TH_2P-P5.00_WJ500V-5.08-2P]  12.36 6.64 90 top
P7  WJ500V-5.08-2P  [CONN-TH_2P-P5.00_WJ500V-5.08-2P]  61.34 31.12 270 top
R1  10mΩ  [R2512]  26.16 71.63 90 top
R2  9.1Ω  [R0603]  30.35 72.64 0 top
R3  9.1Ω  [R0603]  30.35 70.23 0 top
R25  100Ω  [R0603]  44.2 70.99 0 top
R26  10mΩ  [R2512]  25.91 58.67 90 top
R27  9.1Ω  [R0603]  30.35 59.69 0 top
R28  9.1Ω  [R0603]  30.35 57.91 0 top
R29  100Ω  [R0603]  44.2 60.96 0 top
R30  10mΩ  [R2512]  26.03 46.23 90 top
R31  9.1Ω  [R0603]  30.23 47.24 0 top
R32  9.1Ω  [R0603]  30.23 44.83 0 top
R33  100Ω  [R0603]  44.07 45.59 0 top
R34  10mΩ  [R2512]  25.78 33.27 90 top
R35  9.1Ω  [R0603]  30.23 34.29 0 top
R36  9.1Ω  [R0603]  30.23 32.51 0 top
R37  100Ω  [R0603]  44.07 35.56 0 top
R42  100Ω  [R0603]  38.48 19.43 0 top
R47  100Ω  [R0603]  38.41 6.51 0 top
R48  20kΩ  [R0603]  25.15 18.92 0 top
R49  20kΩ  [R0603]  25.15 21.08 0 top
R50  1kΩ  [R0603]  27.69 21.84 90 top
R51  1kΩ  [R0603]  27.69 18.29 90 top
R52  20kΩ  [R0603]  25.15 6.1 0 top
R53  20kΩ  [R0603]  25.15 8.26 0 top
R54  1kΩ  [R0603]  27.69 8.76 90 top
R55  1kΩ  [R0603]  27.56 5.33 90 top
U16  REF3033AIDBZRQ1  [SOT-23-3_L2.9-W1.3-P1.90-LS2.4-BR]  59.56 46.86 0 top
U17  OPA2188AIDR  [SOIC-8_L4.9-W3.9-P1.27-LS6.0-BL]  40 65.53 180 top
U18  OPA2188AIDR  [SOIC-8_L4.9-W3.9-P1.27-LS6.0-BL]  39.88 40.13 180 top
U19  INA240A1PWR  [TSSOP-8_L4.4-W3.0-P0.65-LS6.4-BL]  38.35 71.63 270 top
U20  INA240A1PWR  [TSSOP-8_L4.4-W3.0-P0.65-LS6.4-BL]  38.35 59.06 270 top
U21  INA240A1PWR  [TSSOP-8_L4.4-W3.0-P0.65-LS6.4-BL]  38.23 46.23 270 top
U22  INA240A1PWR  [TSSOP-8_L4.4-W3.0-P0.65-LS6.4-BL]  38.23 33.66 270 top
U23  OPA2188AIDR  [SOIC-8_L4.9-W3.9-P1.27-LS6.0-BL]  32.64 20.19 270 top
U24  OPA2188AIDR  [SOIC-8_L4.9-W3.9-P1.27-LS6.0-BL]  32.57 7.27 270 top

## Footprints (pads in the part's own frame, mm; a bottom-side part is the same pattern mirrored in y, then rotated)
C0603
  rect 0.8x0.9 smd: 1(-0.7,0) 2(0.7,0)
CONN-TH_2P-P2.50_HX25003-2A
  rect 1.8x1.8 hole 1.1: 1(-1.25,0)
  round 1.8 hole 1.1: 2(1.25,0)
CONN-TH_2P-P5.00_WJ500V-5.08-2P
  round 2 hole 1.3: 1(-2.54,0) 2(2.54,0)
CONN-TH_XT30UPB-M
  round 2.5 hole 1.8: 1(-2.5,0) 2(2.5,0)
HDR-TH_2P-P2.54-V-M
  rect 2x2 hole 1.2: 1(-1.27,0)
  round 2 hole 1.2: 2(1.27,0)
Pad_e1005
  round 5.2 hole 3.2: 1(0,0)
Pad_e1006
  round 5.2 hole 3.2: 1(0,0)
Pad_e1007
  round 5.2 hole 3.2: 1(0,0)
Pad_e1009
  round 5.2 hole 3.2: 1(0,0)
R0603
  rect 0.806x0.864 smd: 1(-0.753,0) 2(0.753,0)
R2512
  rect 1.282x3.456 smd: 1(-3.067,0) 2(3.067,0)
SOD-123_L2.8-W1.8-LS3.7-RD
  rect 0.95x1.15 smd: 1(-1.692,0) 2(1.692,0)
SOIC-8_L4.9-W3.9-P1.27-LS6.0-BL
  oval 0.588x2.045 smd: 1(-1.905,-2.772) 2(-0.635,-2.772) 3(0.635,-2.772) 4(1.905,-2.772) 5(1.905,2.772) 6(0.635,2.772) 7(-0.635,2.772) 8(-1.905,2.772)
SOT-23-3_L2.9-W1.3-P1.90-LS2.4-BR
  rect 1.25x0.7 smd: 1(1,-0.95) 2(1,0.95) 3(-1,0)
TSSOP-8_L4.4-W3.0-P0.65-LS6.4-BL
  oval 0.353x1.454 smd: 1(-0.975,-2.927) 2(-0.325,-2.927) 3(0.325,-2.927) 4(0.975,-2.927) 5(0.975,2.927) 6(0.325,2.927) 7(-0.325,2.927) 8(-0.975,2.927)

## Nets
+5V: C75.2 C76.2 C83.2 C84.2 C90.2 C91.2 C92.2 C93.2 CN13.2 P7.2 U16.1 U17.8 U18.8 U19.5 U20.5 U21.5 U22.5 U23.8 U24.8
AGND: C73.1 C74.1 C75.1 C76.1 C77.1 C81.1 C83.1 C84.1 C85.1 C87.1 C88.1 C89.1 C90.1 C91.1 C92.1 C93.1 CN2.2 CN4.2 CN6.2 CN8.2 CN10.2 CN12.2 CN13.1 D1.2 D2.2 NOREF.1 NOREF#2.1 NOREF#3.1 NOREF#4.1 P7.1 R51.1 R55.1 U16.3 U17.4 U18.4 U19.4 U19.6 U20.4 U20.6 U21.4 U21.6 U22.4 U22.6 U23.4 U24.4
VREF: C73.2 C74.2 U16.2 U19.7 U20.7 U21.7 U22.7
$1N413: CN1.2 P1.2 R1.2 R2.1
$1N418: CN1.1 P1.1 R1.1 R3.1
$1N424: C1.2 R2.2 U19.2
$1N430: C1.1 R3.2 U19.3
$1N1225: U17.3 U19.8
$1N1231: R25.1 U17.1 U17.2
$1N1896: C77.2 H1.1 R25.2
$1N2024: CN2.1 H1.2
$1N2786: CN3.2 P2.2 R26.2 R27.1
$1N2793: CN3.1 P2.1 R26.1 R28.1
$1N2800: C78.2 R27.2 U20.2
$1N2806: C78.1 R28.2 U20.3
$1N2841: U17.5 U20.8
$1N2845: R29.1 U17.6 U17.7
$1N2851: C81.2 H2.1 R29.2
$1N2855: CN4.1 H2.2
$1N3511: CN5.2 P3.2 R30.2 R31.1
$1N3518: CN5.1 P3.1 R30.1 R32.1
$1N3525: C82.2 R31.2 U21.2
$1N3531: C82.1 R32.2 U21.3
$1N3566: U18.3 U21.8
$1N3570: R33.1 U18.1 U18.2
$1N3576: C85.2 H3.1 R33.2
$1N3580: CN6.1 H3.2
$1N4143: CN7.2 P4.2 R34.2 R35.1
$1N4150: CN7.1 P4.1 R34.1 R36.1
$1N4157: C86.2 R35.2 U22.2
$1N4163: C86.1 R36.2 U22.3
$1N4185: U18.5 U22.8
$1N4189: R37.1 U18.6 U18.7
$1N4195: C87.2 H4.1 R37.2
$1N4199: CN8.1 H4.2
$1N4614: CN9.1 P5.1 R48.1
$1N4617: R48.2 R51.2 U23.3
$1N4658: CN9.2 P5.2 R49.1
$1N4661: R49.2 R50.1 U23.2
$1N4794: R50.2 U23.1 U23.5
$1N4838: R42.1 U23.6 U23.7
$1N4916: C88.2 D1.1 H5.1 R42.2
$1N5160: CN10.1 H5.2
$1N5836: CN11.1 P6.1 R52.1
$1N5842: R52.2 R55.2 U24.3
$1N5846: CN11.2 P6.2 R53.1
$1N5852: R53.2 R54.1 U24.2
$1N5856: R54.2 U24.1 U24.5
$1N5871: R47.1 U24.6 U24.7
$1N5877: C89.2 D2.1 H6.1 R47.2
$1N5883: CN12.1 H6.2

Pads without a net: U19 1; U20 1; U21 1; U22 1

## Via types
v1: diameter 0.61, hole 0.305, Top Layer to Bottom Layer, 152 vias

## Routing (per net, layer and track width the routed paths; a pad name or vN(x,y) marks a point on that pad's centre or on a via; arc(x,y) is an arc through that point)
+5V: length 57.9
  Top Layer w0.508: C76.2 C75.2 44.64,66.55 v1(41.53,66.55) 41.91,66.17 U17.8 ; U24.8 35.83,9.18 C93.2 ; U18.8 41.78,38.8 41.91,38.92 ; 35.5,26.42 35.5,22.18 U23.8 ; 41.91,38.92 C84.2 C83.2 ; 41.91,38.92 v1(41.53,38.92) ; U21.5 v1(39.88,45.25) ; U22.5 39.96,32.68 v1(39.88,32.77) ; U20.5 v1(39.88,58.08) ; U19.5 39.88,70.65
  Bottom Layer w0.508: v1(39.88,45.25) 39.88,38.99 ; 39.88,38.99 v1(39.88,32.77) ; 39.88,38.99 39.94,38.92 v1(41.53,38.92) ; 39.95,66.55 v1(41.53,66.55) ; 39.95,66.55 v1(39.95,70.65) ; 39.95,66.55 39.95,58.16 v1(39.88,58.08)
AGND: length 3.7
  Top Layer w0.254: v1(39.86,46.23) 40.1,45.99 41.14,45.99 41.15,45.97 U21.6 ; C81.1 43.43,58.73 U20.6
  vias: v1(2.16,40.26) v1(2.16,39.36) v1(2.16,7.62) v1(2.16,6.72) v1(2.67,70.74) v1(2.67,69.84) v1(2.92,40.24) v1(2.92,39.35) v1(2.92,7.61) v1(2.92,6.71) v1(3.43,70.72) v1(3.43,69.83) v1(3.81,40.26) v1(3.81,39.36) v1(3.81,7.62) v1(3.81,6.72) v1(4.32,70.74) v1(4.32,69.84) v1(29.21,4.32) v1(29.21,3.41) v1(29.46,17.4) v1(29.46,16.5) v1(29.97,4.3) v1(29.97,3.41) v1(30.23,17.38) v1(30.23,16.49) v1(30.86,4.32) v1(30.86,3.41) v1(31.12,17.4) v1(31.12,16.5) v1(34.93,31.88) v1(34.93,30.97) v1(35.05,69.47) v1(35.05,68.57) v1(35.05,56.89) v1(35.05,55.99) v1(35.69,31.86) v1(35.69,30.97) v1(35.81,69.45) v1(35.81,68.56) v1(35.81,56.88) v1(35.81,55.99) v1(35.8,43.69) v1(35.8,42.93) v1(35.8,42.04) v1(36.58,31.88) v1(36.58,30.97) v1(36.7,69.47) v1(36.7,68.57) v1(36.7,56.9) v1(36.7,55.99) v1(36.7,43.69) v1(36.69,42.93) v1(36.7,42.04) v1(39.12,14.48) v1(39.12,13.57) v1(39.88,14.46) v1(39.88,13.57) v1(40,71.5) v1(40.39,4.06) v1(40.39,3.16) v1(40.51,16.89) v1(40.51,15.99) v1(40.77,14.48) v1(40.77,13.57) v1(41.15,4.05) v1(41.15,3.16) v1(41.28,16.88) v1(41.28,15.98) v1(42.04,4.06) v1(42.04,3.16) v1(42.16,16.89) v1(42.16,15.99) v1(43.18,30.99) v1(43.18,30.08) v1(43.43,56.37) v1(43.43,55.48) v1(43.94,30.97) v1(43.94,30.08) v1(44.32,56.39) v1(44.32,55.48) v1(44.83,30.99) v1(44.83,30.08) v1(48.26,65.28) v1(48.26,64.37) v1(49.02,65.26) v1(49.02,64.37) v1(49.91,65.28) v1(49.91,64.37) v1(51.62,9.08) v1(51.62,8.32) v1(51.62,7.43) v1(51.75,22.42) v1(51.74,21.65) v1(51.75,20.76) v1(52.52,9.08) v1(52.51,8.32) v1(52.52,7.43) v1(52.65,22.42) v1(52.64,21.65) v1(52.65,20.76) v1(53.52,48.32) v1(53.52,47.56) v1(53.52,46.67) v1(53.71,73.79) v1(53.7,73.03) v1(53.71,72.14) v1(53.78,60.01) v1(53.78,59.25) v1(53.78,58.36) v1(53.85,33.78) v1(53.85,33.02) v1(53.85,32.13) v1(54.43,48.32) v1(54.41,47.56) v1(54.43,46.67) v1(54.61,73.79) v1(54.59,73.03) v1(54.61,72.14) v1(54.68,60.01) v1(54.67,59.25) v1(54.68,58.36) v1(54.75,33.78) v1(54.74,33.02) v1(54.75,32.13) v1(63.63,70.99) v1(63.63,70.09) v1(63.63,8.13) v1(63.63,7.22) v1(64.39,70.98) v1(64.39,70.09) v1(64.39,8.11) v1(64.39,7.22) v1(65.28,70.99) v1(65.28,70.09) v1(65.28,8.13) v1(65.28,7.22)
VREF: length 5.4
  Top Layer w0.254: U20.7 42.45,59.38 v1(42.53,59.45) ; U21.7 42.43,46.55 v1(42.47,46.52) ; U22.7 42.15,33.98 v1(42.53,34.37) ; v1(42.55,71.88) 42.47,71.95 U19.7
  vias: v1(42.67,56.39) v1(42.67,55.48) v1(60.45,53.47) v1(61.24,53.47)
$1N424: length 5.1
  Top Layer w0.254: R2.2 31.06,72.6 31.06,72.19 31.24,72.01 32.96,72.01 C1.2 33.4,71.95 U19.2
$1N430: length 5.4
  Top Layer w0.254: R3.2 31.06,70.28 31.06,70.81 31.24,70.99 32.96,70.99 C1.1 33.15,70.99 33.46,71.3 U19.3
$1N1225: length 6
  Top Layer w0.254: U17.3 39.37,72.26 39.71,72.6 U19.8
$1N1231: length 5.1
  Top Layer w0.254: R25.1 43.44,70.11 43.18,69.85 42.29,69.85 41.91,69.47 U17.1 U17.2
$1N1896: length 4.5
  Top Layer w0.254: H1.1 C77.2 44.9,71.05 R25.2
$1N2024: length 4.7
  Top Layer w0.254: CN2.1 52.09,70.36 H1.2
$1N2800: length 4.4
  Top Layer w0.254: R27.2 31.3,59.5 C78.2 33.27,59.38 U20.2
$1N2806: length 4.8
  Top Layer w0.254: R28.2 31.3,58.1 C78.1 33.15,58.42 33.46,58.73 U20.3
$1N2841: length 5.6
  Top Layer w0.254: U20.8 38.65,60.03 38.1,60.58 U17.5
$1N2845: length 5.6
  Top Layer w0.254: U17.6 U17.7 40.64,61.47 41.15,60.96 R29.1
$1N2851: length 4.9
  Top Layer w0.254: R29.2 44.95,58.85 C81.2 47.12,58.8 H2.1
$1N2855: length 4.7
  Top Layer w0.254: CN4.1 52.09,56.64 H2.2
$1N3525: length 5.1
  Top Layer w0.254: U21.2 33.27,46.55 C82.2 32.83,46.61 31.12,46.61 30.98,46.74 R31.2
$1N3531: length 5.4
  Top Layer w0.254: R32.2 30.98,45.2 31.18,45.4 C82.1 32.86,45.56 32.86,45.73 33.03,45.9 U21.3
$1N3566: length 6
  Top Layer w0.254: U18.3 39.24,46.86 39.58,47.2 U21.8
$1N3570: length 5.1
  Top Layer w0.254: U18.2 U18.1 41.8,42.93 42.67,42.93 43.32,43.57 R33.1
$1N3576: length 4.5
  Top Layer w0.254: H3.1 C85.2 44.77,45.65 R33.2
$1N3580: length 4.7
  Top Layer w0.254: CN6.1 51.96,44.96 H3.2
$1N4157: length 4.4
  Top Layer w0.254: U22.2 33.14,33.98 C86.2 31.17,34.1 R35.2
$1N4163: length 4.8
  Top Layer w0.254: U22.3 35.24,33.27 33.27,33.27 33.02,33.02 C86.1 32.83,32.51 R36.2
$1N4185: length 5.6
  Top Layer w0.254: U22.8 38.52,34.63 37.97,35.18 U18.5
$1N4189: length 5.6
  Top Layer w0.254: U18.6 U18.7 40.51,35.94 40.89,35.56 R37.1
$1N4195: length 4.9
  Top Layer w0.254: H4.1 46.99,33.4 C87.2 44.82,33.45 R37.2
$1N4199: length 4.7
  Top Layer w0.254: H4.2 51.96,31.24 CN8.1
$1N4617: length 4.4
  Top Layer w0.254: 26.03,18.92 26.03,18.91 27.69,18.91 27.69,19.43 27.81,19.56 U23.3
$1N4661: length 4
  Top Layer w0.254: U23.2 27.95,20.83 R50.1 27.68,21.08 26.03,21.08
$1N4794: length 11.5
  Top Layer w0.254: R50.2 27.69,22.1 27.81,21.97 29.74,21.97 U23.1 32.51,22.1 33.4,21.21 33.4,18.54 33.66,18.29 U23.5
$1N4838: length 3.6
  Top Layer w0.254: R42.1 37.6,19.56 U23.6 U23.7
$1N4916: length 7.4
  Top Layer w0.254: R42.2 39.18,19.48 C88.2 44.45,21.34 44.58,21.21
$1N5160: length 5.6
  Top Layer w0.254: H5.2 49.64,18.67 CN10.1
$1N5842: length 4.4
  Top Layer w0.254: U24.3 27.72,6.64 27.62,6.53 27.62,5.99 27.61,6 25.96,6
$1N5852: length 3.9
  Top Layer w0.254: 25.96,8.16 26.08,8.04 29.66,8.04 U24.2
$1N5856: length 10.9
  Top Layer w0.254: U24.5 33.62,5.37 33.27,5.72 33.27,8.26 32.35,9.18 U24.1 27.99,9.18 27.62,9.55
$1N5871: length 3.6
  Top Layer w0.254: U24.7 U24.6 37.53,6.64 R47.1
$1N5877: length 7.4
  Top Layer w0.254: H6.1 44.38,8.42 C89.2 39.11,6.56 R47.2
$1N5883: length 5.5
  Top Layer w0.254: CN12.1 49.86,5.75 H6.2

## Copper pours and planes (outline as drawn; the poured copper is in the pictures)
+5V on Top Layer: 35.08,66.81 65.91,66.81 65.91,11.94 35.08,11.94
AGND on Top Layer: -3.94,80.39 70.87,80.39 70.87,-2.03 -3.94,-2.03
AGND on Bottom Layer: -1.52,79.76 69.09,79.76 69.09,-1.27 -1.52,-1.27
VREF on Top Layer: 60.1,53.85 61.59,53.85 61.59,47.5 60.1,47.5
VREF on Bottom Layer: 42.16,72.26 61.59,72.26 61.59,33.94 42.16,33.94
$1N413 on Top Layer: 10.42,75.31 29.99,75.31 29.99,71.88 10.42,71.88
$1N418 on Top Layer: 10.46,71.37 29.96,71.37 29.96,67.63 10.46,67.63
$1N2786 on Top Layer: 10.28,62.64 29.85,62.64 29.85,59.21 10.28,59.21
$1N2793 on Top Layer: 10.32,58.71 29.82,58.71 29.82,54.96 10.32,54.96
$1N3511 on Top Layer: 10.26,49.95 29.85,49.95 29.85,46.52 10.26,46.52
$1N3518 on Top Layer: 10.29,46.01 29.82,46.01 29.82,42.52 10.29,42.52
$1N4143 on Top Layer: 10.67,37.08 29.88,37.08 29.88,33.53 10.67,33.53
$1N4150 on Top Layer: 10.67,33.02 29.86,33.02 29.86,29.34 10.67,29.34
$1N4614 on Top Layer: 10.67,19.3 24.48,19.3 24.48,15.24 10.67,15.24
$1N4658 on Top Layer: 10.67,23.24 24.89,23.24 24.89,20.57 10.67,20.57
$1N5836 on Top Layer: 10.67,6.45 24.48,6.45 24.48,2.39 10.67,2.39
$1N5846 on Top Layer: 10.67,10.39 24.89,10.39 24.89,7.72 10.67,7.72

Small or netless copper shapes (teardrops, artwork), in the pictures only: 151 on Top Layer, 8 on Bottom Layer

## Text on the board
Bottom Silkscreen Layer: AGND | +5V | IN+ | IN- | 电压采样1 | 电压采样2 | 电流采样2 | 电流采样3 | 电流采样4 | 电流采样1 | 电压电流采样板： / 电流放大20倍， / 电压缩小20倍 / 2025/7/21
Top Silkscreen Layer: IN+ | IN- | AGND | +5V
